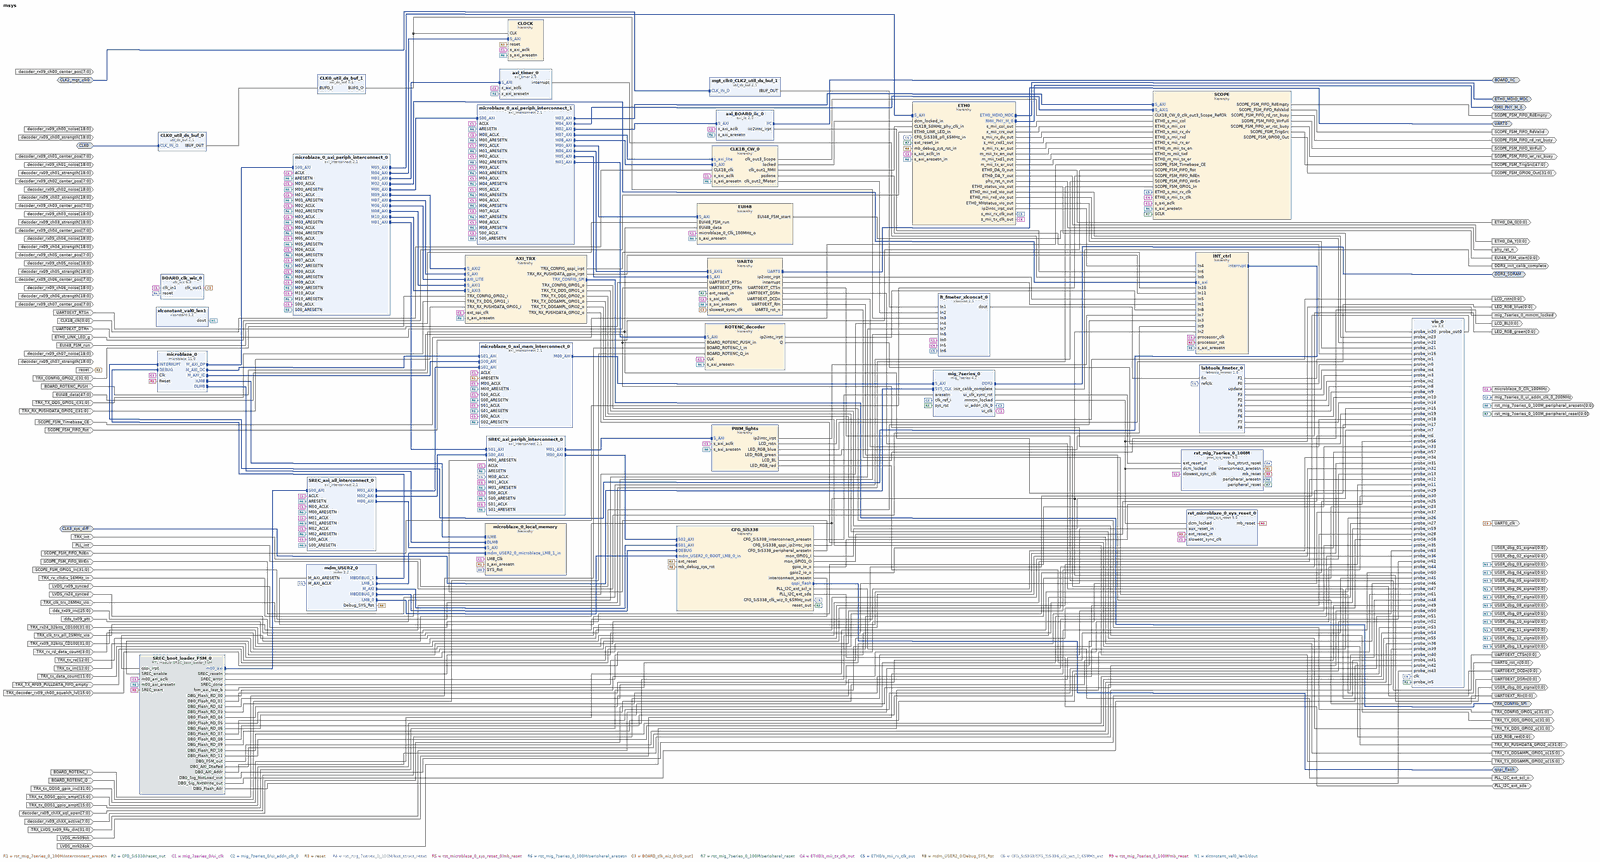
[diagram p0: block diagram of the top level, whole]
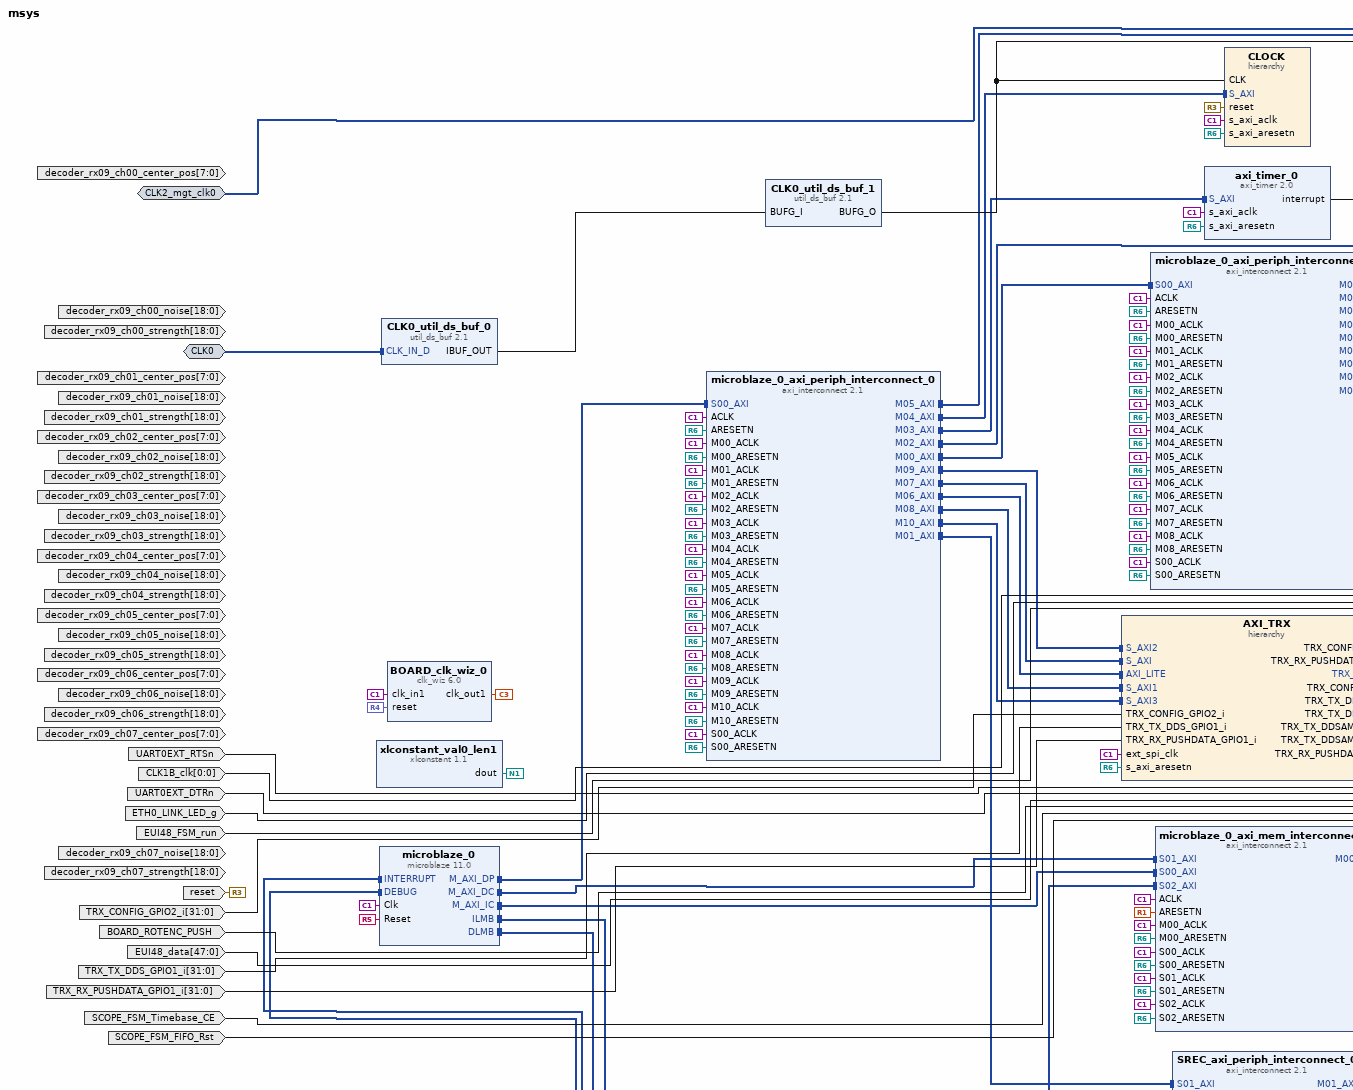
[diagram p1: block diagram of the top level, upper left part]
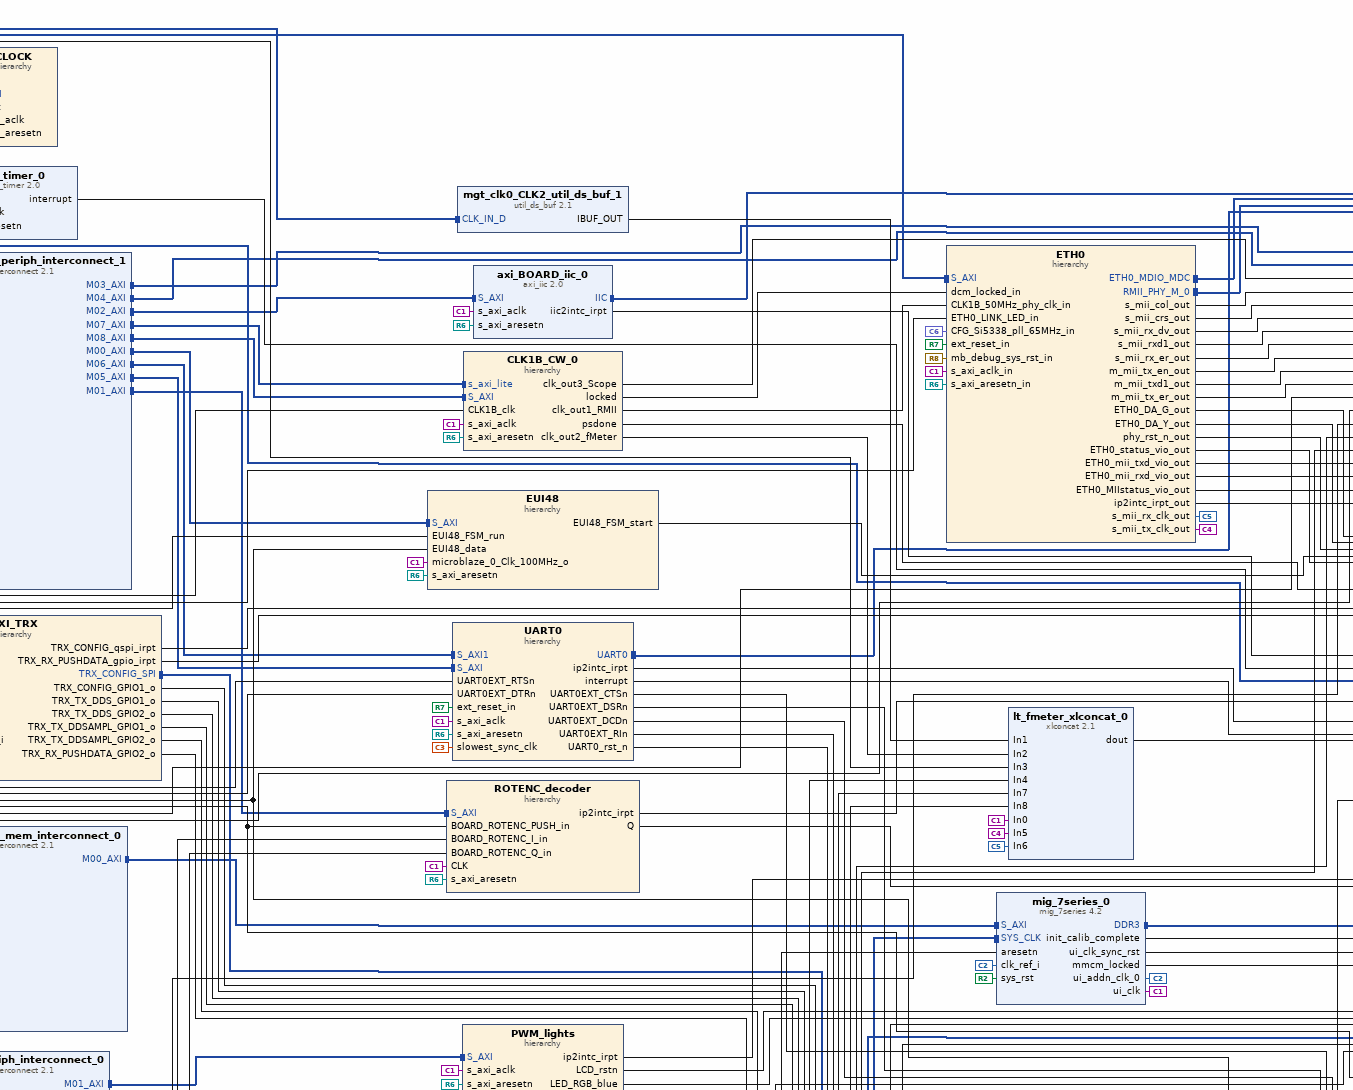
[diagram p2: block diagram of the top level, upper centre part]
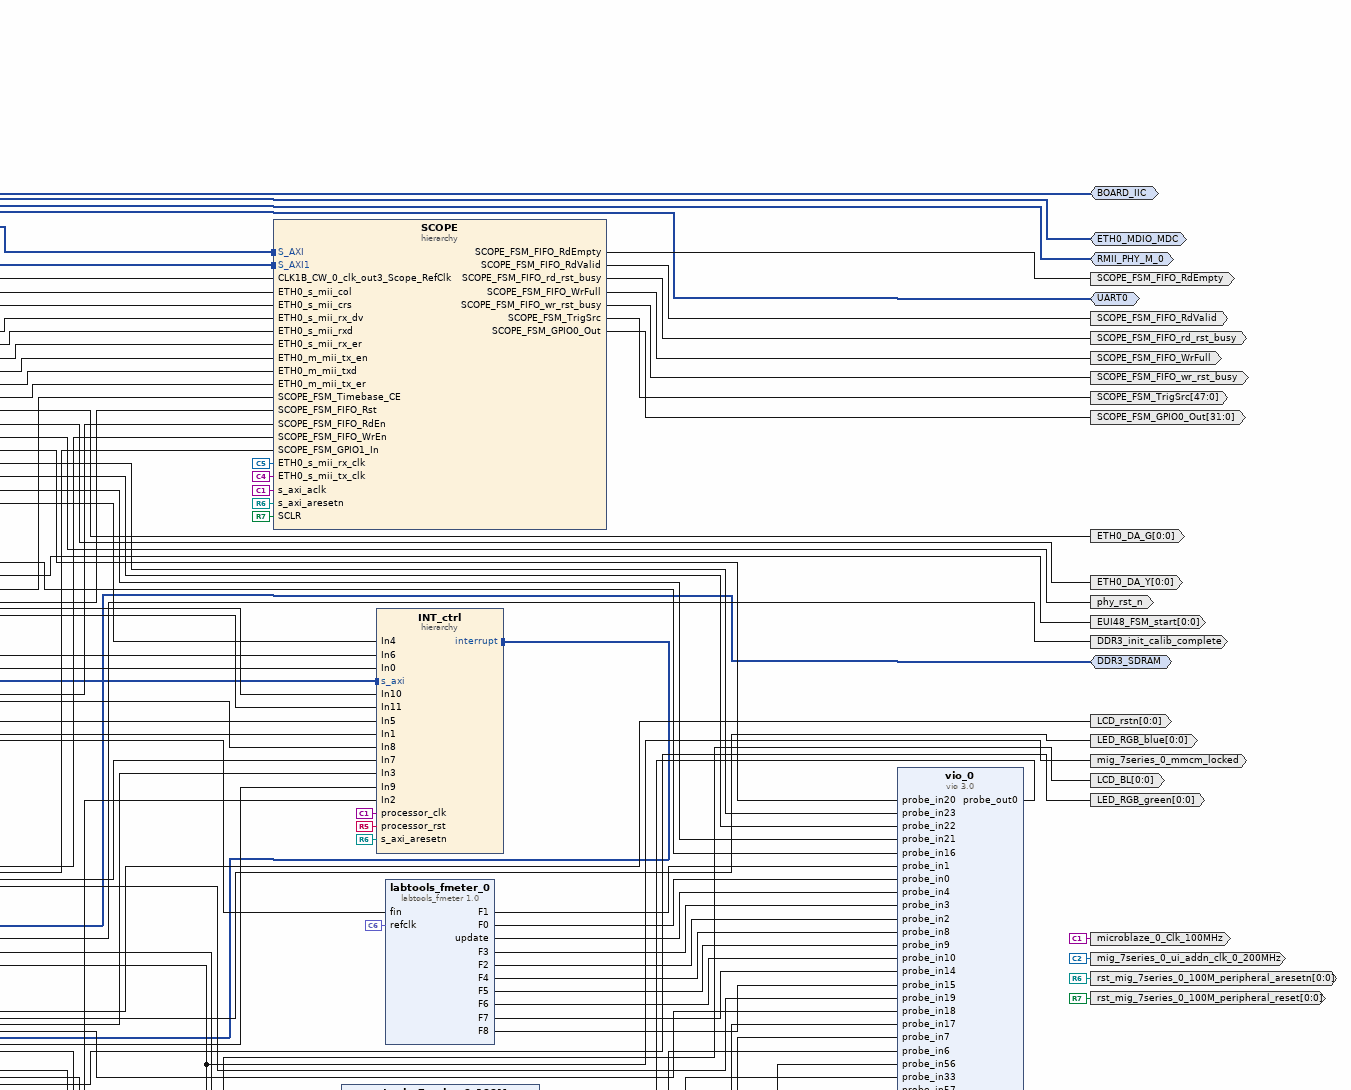
[diagram p3: block diagram of the top level, upper right part]
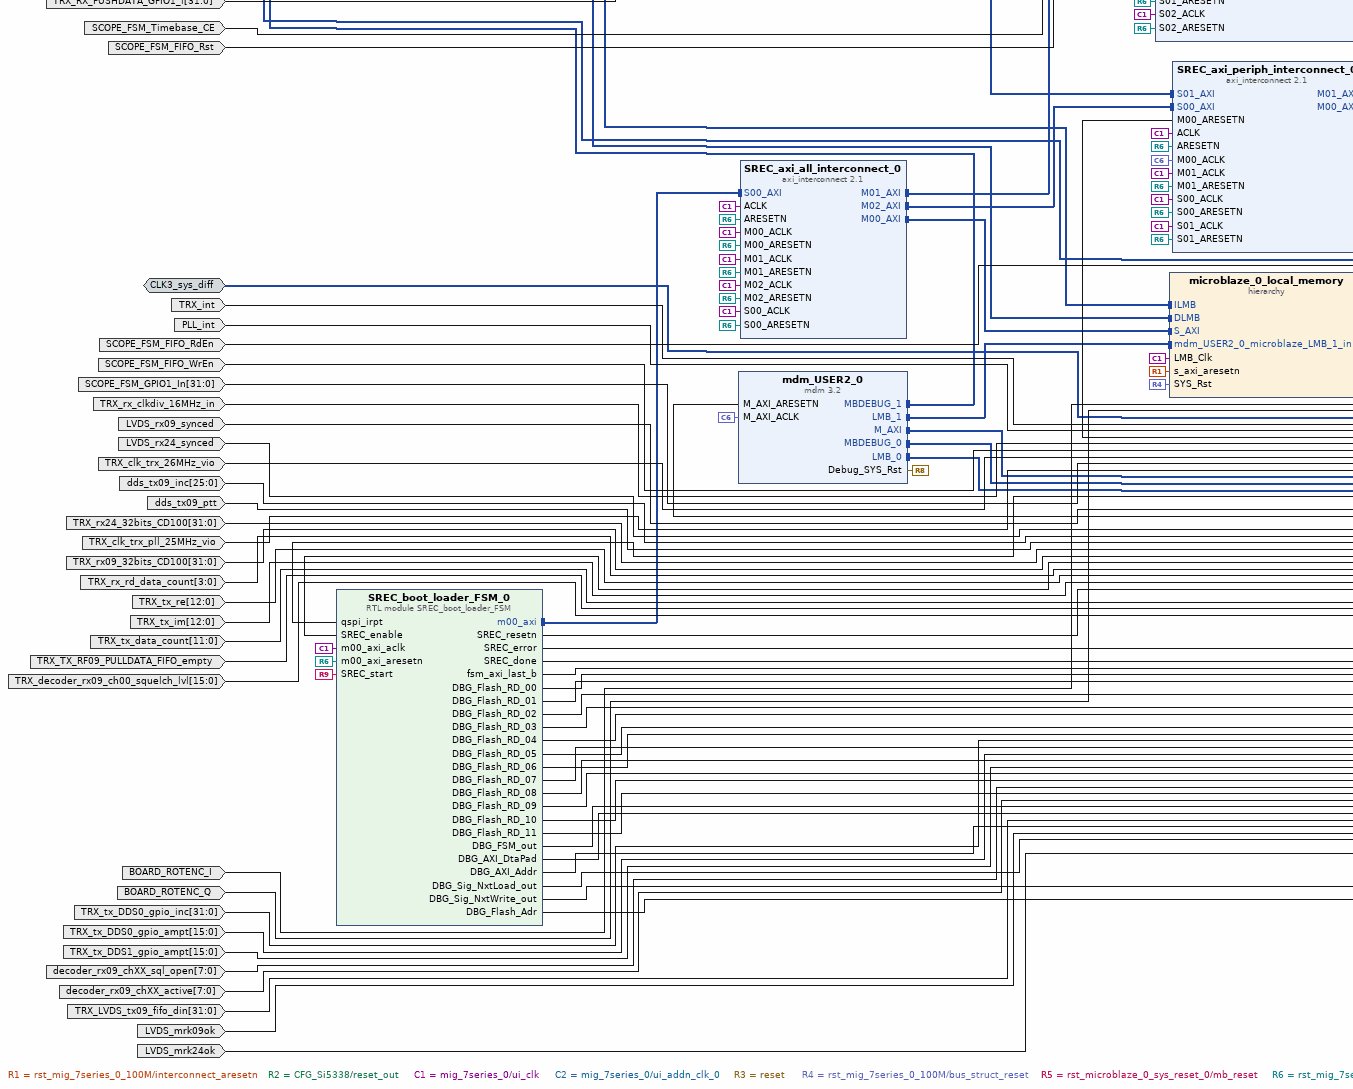
[diagram p4: block diagram of the top level, lower left part]
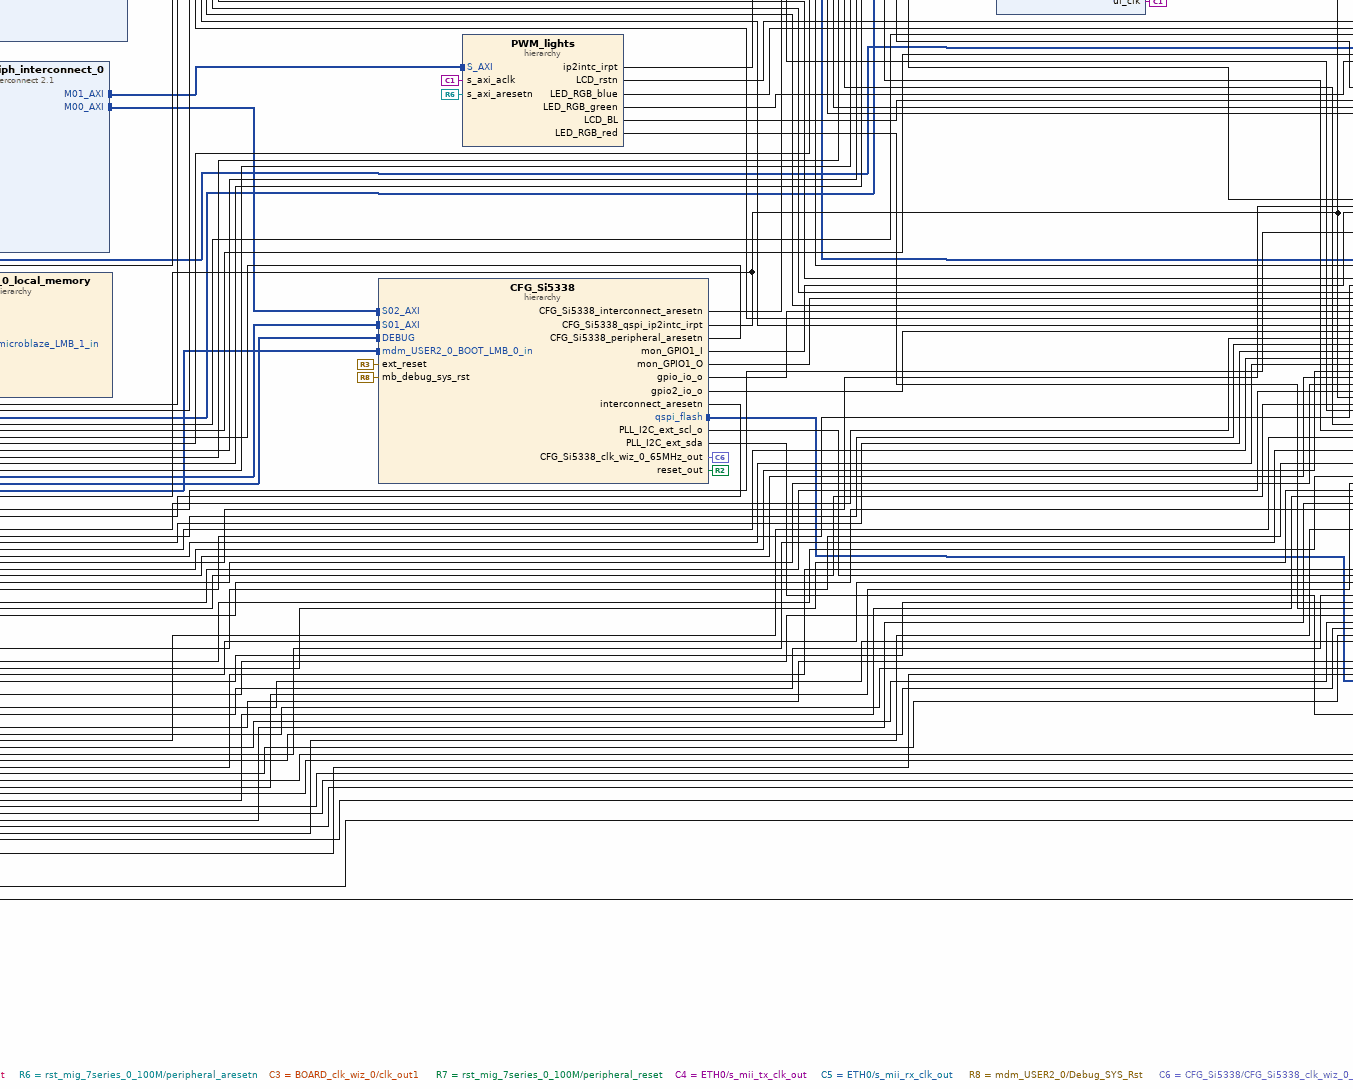
[diagram p5: block diagram of the top level, lower centre part]
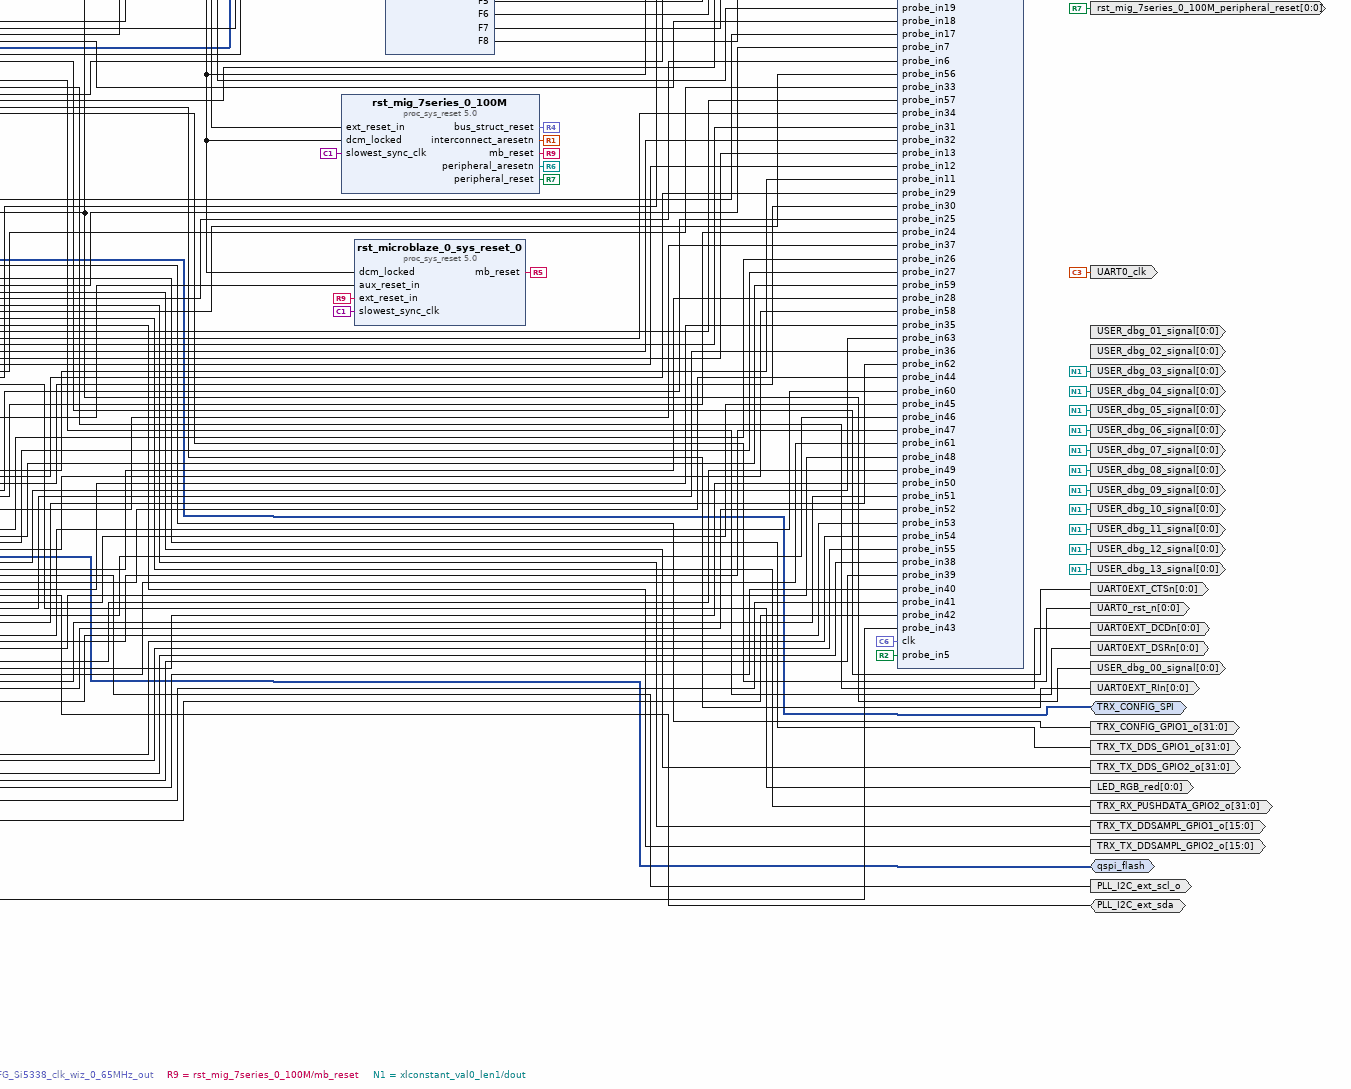
[diagram p6: block diagram of the top level, lower right part]
# Vivado block design msys, xc7a100tfgg484-2, Vivado 2020.2.2
create_bd_design msys

create_bd_intf_port -mode Slave -vlnv xilinx.com:interface:diff_clock_rtl:1.0 CLK0
create_bd_intf_port -mode Master -vlnv xilinx.com:interface:ddrx_rtl:1.0 DDR3_SDRAM
create_bd_intf_port -mode Master -vlnv xilinx.com:interface:mdio_rtl:1.0 ETH0_MDIO_MDC
create_bd_intf_port -mode Master -vlnv xilinx.com:interface:rmii_rtl:1.0 RMII_PHY_M_0
create_bd_intf_port -mode Master -vlnv xilinx.com:interface:uart_rtl:1.0 UART0
create_bd_intf_port -mode Slave -vlnv xilinx.com:interface:diff_clock_rtl:1.0 CLK2_mgt_clk0
set_property -dict {CONFIG.FREQ_HZ 125000000} [get_bd_intf_ports CLK2_mgt_clk0]
create_bd_intf_port -mode Master -vlnv xilinx.com:interface:spi_rtl:1.0 qspi_flash
create_bd_intf_port -mode Slave -vlnv xilinx.com:interface:diff_clock_rtl:1.0 CLK3_sys_diff
set_property -dict {CONFIG.FREQ_HZ 50000000} [get_bd_intf_ports CLK3_sys_diff]
create_bd_intf_port -mode Master -vlnv xilinx.com:interface:iic_rtl:1.0 BOARD_IIC
create_bd_intf_port -mode Master -vlnv xilinx.com:interface:spi_rtl:1.0 TRX_CONFIG_SPI
create_bd_port -dir O PLL_I2C_ext_scl_o
create_bd_port -dir IO PLL_I2C_ext_sda
create_bd_port -dir O phy_rst_n
create_bd_port -dir I -type rst reset
set_property -dict {CONFIG.POLARITY ACTIVE_HIGH} [get_bd_ports reset]
create_bd_port -dir I UART0EXT_RTSn
create_bd_port -dir I UART0EXT_DTRn
create_bd_port -dir O -from 0 -to 0 UART0EXT_CTSn
create_bd_port -dir O -from 0 -to 0 UART0EXT_DSRn
create_bd_port -dir O -from 0 -to 0 UART0EXT_DCDn
create_bd_port -dir O -from 0 -to 0 UART0EXT_RIn
create_bd_port -dir O -from 0 -to 0 -type rst UART0_rst_n
create_bd_port -dir O -type clk UART0_clk
set_property -dict {CONFIG.ASSOCIATED_RESET UART0_rst_n CONFIG.FREQ_HZ 12000000} [get_bd_ports UART0_clk]
create_bd_port -dir O DDR3_init_calib_complete
create_bd_port -dir O -from 0 -to 0 ETH0_DA_Y
create_bd_port -dir O -from 0 -to 0 ETH0_DA_G
create_bd_port -dir I ETH0_LINK_LED_g
create_bd_port -dir O -from 0 -to 0 LED_RGB_red
create_bd_port -dir O -from 0 -to 0 LED_RGB_green
create_bd_port -dir O -from 0 -to 0 LED_RGB_blue
create_bd_port -dir O -from 0 -to 0 LCD_BL
create_bd_port -dir O -from 0 -to 0 -type rst LCD_rstn
create_bd_port -dir O -type clk microblaze_0_Clk_100MHz
set_property -dict {CONFIG.ASSOCIATED_RESET rst_mig_7series_0_100M_peripheral_aresetn} [get_bd_ports microblaze_0_Clk_100MHz]
create_bd_port -dir I BOARD_ROTENC_PUSH
create_bd_port -dir I -type intr PLL_int
create_bd_port -dir I -type intr TRX_int
create_bd_port -dir I -from 0 -to 0 -type clk CLK1B_clk
set_property -dict {CONFIG.FREQ_HZ 50000000} [get_bd_ports CLK1B_clk]
create_bd_port -dir O -from 0 -to 0 EUI48_FSM_start
create_bd_port -dir I EUI48_FSM_run
create_bd_port -dir I -from 47 -to 0 -type data EUI48_data
create_bd_port -dir I -type ce SCOPE_FSM_Timebase_CE
set_property -dict {CONFIG.POLARITY ACTIVE_HIGH} [get_bd_ports SCOPE_FSM_Timebase_CE]
create_bd_port -dir I -type rst SCOPE_FSM_FIFO_Rst
set_property -dict {CONFIG.POLARITY ACTIVE_HIGH} [get_bd_ports SCOPE_FSM_FIFO_Rst]
create_bd_port -dir I SCOPE_FSM_FIFO_RdEn
create_bd_port -dir O SCOPE_FSM_FIFO_WrFull
create_bd_port -dir O SCOPE_FSM_FIFO_RdValid
create_bd_port -dir O SCOPE_FSM_FIFO_RdEmpty
create_bd_port -dir O -from 47 -to 0 SCOPE_FSM_TrigSrc
create_bd_port -dir I SCOPE_FSM_FIFO_WrEn
create_bd_port -dir O SCOPE_FSM_FIFO_rd_rst_busy
create_bd_port -dir O SCOPE_FSM_FIFO_wr_rst_busy
create_bd_port -dir O -from 31 -to 0 SCOPE_FSM_GPIO0_Out
create_bd_port -dir I -from 31 -to 0 SCOPE_FSM_GPIO1_In
create_bd_port -dir I LVDS_rx09_synced
create_bd_port -dir I LVDS_rx24_synced
create_bd_port -dir I -from 7 -to 0 -type data decoder_rx09_ch00_center_pos
create_bd_port -dir I -from 18 -to 0 -type data decoder_rx09_ch00_strength
create_bd_port -dir I -from 18 -to 0 -type data decoder_rx09_ch00_noise
create_bd_port -dir I -from 25 -to 0 dds_tx09_inc
create_bd_port -dir I dds_tx09_ptt
create_bd_port -dir O mig_7series_0_mmcm_locked
create_bd_port -dir O -from 0 -to 0 -type rst rst_mig_7series_0_100M_peripheral_reset
create_bd_port -dir I -type clk TRX_rx_clkdiv_16MHz_in
set_property -dict {CONFIG.FREQ_HZ 16000000} [get_bd_ports TRX_rx_clkdiv_16MHz_in]
create_bd_port -dir I -from 31 -to 0 -type data TRX_rx24_32bits_CD100
create_bd_port -dir I -from 31 -to 0 -type data TRX_rx09_32bits_CD100
create_bd_port -dir I -from 3 -to 0 -type data TRX_rx_rd_data_count
create_bd_port -dir I -type clk TRX_clk_trx_26MHz_vio
set_property -dict {CONFIG.FREQ_HZ 26000000} [get_bd_ports TRX_clk_trx_26MHz_vio]
create_bd_port -dir I -type clk TRX_clk_trx_pll_25MHz_vio
set_property -dict {CONFIG.FREQ_HZ 25000000} [get_bd_ports TRX_clk_trx_pll_25MHz_vio]
create_bd_port -dir I -from 12 -to 0 -type data TRX_tx_re
create_bd_port -dir I -from 12 -to 0 -type data TRX_tx_im
create_bd_port -dir I -from 11 -to 0 -type data TRX_tx_data_count
create_bd_port -dir I TRX_TX_RF09_PULLDATA_FIFO_empty
create_bd_port -dir I -from 15 -to 0 -type data TRX_decoder_rx09_ch00_squelch_lvl
create_bd_port -dir I -from 31 -to 0 -type data TRX_tx_DDS0_gpio_inc
create_bd_port -dir I -from 15 -to 0 -type data TRX_tx_DDS0_gpio_ampt
create_bd_port -dir I -from 15 -to 0 -type data TRX_tx_DDS1_gpio_ampt
create_bd_port -dir O -type clk mig_7series_0_ui_addn_clk_0_200MHz
create_bd_port -dir I -from 7 -to 0 decoder_rx09_chXX_sql_open
create_bd_port -dir I -from 7 -to 0 decoder_rx09_chXX_active
create_bd_port -dir I -from 18 -to 0 -type data decoder_rx09_ch01_noise
create_bd_port -dir I -from 18 -to 0 -type data decoder_rx09_ch02_noise
create_bd_port -dir I -from 18 -to 0 -type data decoder_rx09_ch03_noise
create_bd_port -dir I -from 18 -to 0 -type data decoder_rx09_ch04_noise
create_bd_port -dir I -from 18 -to 0 -type data decoder_rx09_ch05_noise
create_bd_port -dir I -from 18 -to 0 -type data decoder_rx09_ch06_noise
create_bd_port -dir I -from 18 -to 0 -type data decoder_rx09_ch07_noise
create_bd_port -dir I -from 18 -to 0 -type data decoder_rx09_ch01_strength
create_bd_port -dir I -from 18 -to 0 -type data decoder_rx09_ch02_strength
create_bd_port -dir I -from 18 -to 0 -type data decoder_rx09_ch03_strength
create_bd_port -dir I -from 18 -to 0 -type data decoder_rx09_ch04_strength
create_bd_port -dir I -from 18 -to 0 -type data decoder_rx09_ch05_strength
create_bd_port -dir I -from 18 -to 0 -type data decoder_rx09_ch06_strength
create_bd_port -dir I -from 18 -to 0 -type data decoder_rx09_ch07_strength
create_bd_port -dir I -from 7 -to 0 -type data decoder_rx09_ch01_center_pos
create_bd_port -dir I -from 7 -to 0 -type data decoder_rx09_ch02_center_pos
create_bd_port -dir I -from 7 -to 0 -type data decoder_rx09_ch03_center_pos
create_bd_port -dir I -from 7 -to 0 -type data decoder_rx09_ch04_center_pos
create_bd_port -dir I -from 7 -to 0 -type data decoder_rx09_ch05_center_pos
create_bd_port -dir I -from 7 -to 0 -type data decoder_rx09_ch06_center_pos
create_bd_port -dir I -from 7 -to 0 -type data decoder_rx09_ch07_center_pos
create_bd_port -dir O -from 31 -to 0 TRX_CONFIG_GPIO1_o
create_bd_port -dir I -from 31 -to 0 TRX_CONFIG_GPIO2_i
create_bd_port -dir O -from 31 -to 0 TRX_TX_DDS_GPIO1_o
create_bd_port -dir I -from 31 -to 0 TRX_TX_DDS_GPIO1_i
create_bd_port -dir O -from 31 -to 0 TRX_TX_DDS_GPIO2_o
create_bd_port -dir O -from 15 -to 0 TRX_TX_DDSAMPL_GPIO1_o
create_bd_port -dir O -from 15 -to 0 TRX_TX_DDSAMPL_GPIO2_o
create_bd_port -dir I -from 31 -to 0 TRX_RX_PUSHDATA_GPIO1_i
create_bd_port -dir O -from 31 -to 0 TRX_RX_PUSHDATA_GPIO2_o
create_bd_port -dir I -from 31 -to 0 -type data TRX_LVDS_tx09_fifo_din
create_bd_port -dir I LVDS_mrk09ok
create_bd_port -dir I LVDS_mrk24ok
create_bd_port -dir O -from 0 -to 0 -type rst rst_mig_7series_0_100M_peripheral_aresetn
create_bd_port -dir O -from 0 -to 0 USER_dbg_02_signal
create_bd_port -dir O -from 0 -to 0 USER_dbg_00_signal
create_bd_port -dir O -from 0 -to 0 USER_dbg_04_signal
create_bd_port -dir O -from 0 -to 0 USER_dbg_05_signal
create_bd_port -dir O -from 0 -to 0 USER_dbg_06_signal
create_bd_port -dir O -from 0 -to 0 USER_dbg_07_signal
create_bd_port -dir O -from 0 -to 0 USER_dbg_08_signal
create_bd_port -dir O -from 0 -to 0 USER_dbg_09_signal
create_bd_port -dir O -from 0 -to 0 USER_dbg_10_signal
create_bd_port -dir O -from 0 -to 0 USER_dbg_11_signal
create_bd_port -dir O -from 0 -to 0 USER_dbg_12_signal
create_bd_port -dir O -from 0 -to 0 USER_dbg_13_signal
create_bd_port -dir O -from 0 -to 0 USER_dbg_01_signal
create_bd_port -dir O -from 0 -to 0 USER_dbg_03_signal
create_bd_port -dir I BOARD_ROTENC_I
create_bd_port -dir I BOARD_ROTENC_Q

create_bd_cell -type ip -vlnv trenz.biz:user:labtools_fmeter:1.0 labtools_fmeter_0
set_property -dict {CONFIG.C_CHANNELS 9 CONFIG.C_REFCLK_HZ 65000000} [get_bd_cells labtools_fmeter_0]
create_bd_cell -type hier microblaze_0_local_memory
create_bd_cell -type ip -vlnv xilinx.com:ip:mig_7series:4.2 mig_7series_0
set_property -dict [list \
  CONFIG.BOARD_MIG_PARAM DDR3_SDRAM \
  CONFIG.RESET_BOARD_INTERFACE Custom \
  CONFIG.XML_INPUT_FILE mig_a.prj \
] [get_bd_cells mig_7series_0]
create_bd_cell -type ip -vlnv xilinx.com:ip:proc_sys_reset:5.0 rst_mig_7series_0_100M
create_bd_cell -type ip -vlnv xilinx.com:ip:vio:3.0 vio_0
set_property -dict [list \
  CONFIG.C_NUM_PROBE_IN 64 \
  CONFIG.C_NUM_PROBE_OUT 1 \
  CONFIG.C_PROBE_OUT0_INIT_VAL 1 \
  CONFIG.C_PROBE_OUT0_WIDTH 1 \
  CONFIG.C_PROBE_OUT1_INIT_VAL 0x00100 \
  CONFIG.C_PROBE_OUT1_WIDTH 19 \
] [get_bd_cells vio_0]
create_bd_cell -type hier UART0
create_bd_cell -type hier PWM_lights
create_bd_cell -type hier ROTENC_decoder
create_bd_cell -type hier ETH0
create_bd_cell -type hier INT_ctrl
create_bd_cell -type hier EUI48
create_bd_cell -type hier CLK1B_CW_0
create_bd_cell -type hier SCOPE
create_bd_cell -type hier CFG_Si5338
create_bd_cell -type hier CLOCK
create_bd_cell -type hier AXI_TRX
create_bd_cell -type ip -vlnv xilinx.com:ip:proc_sys_reset:5.0 rst_microblaze_0_sys_reset_0
create_bd_cell -type ip -vlnv xilinx.com:ip:xlconstant:1.1 xlconstant_val0_len1
create_bd_cell -type ip -vlnv xilinx.com:ip:util_ds_buf:2.1 CLK0_util_ds_buf_1
set_property -dict {CONFIG.C_BUF_TYPE BUFG} [get_bd_cells CLK0_util_ds_buf_1]
create_bd_cell -type ip -vlnv xilinx.com:ip:axi_iic:2.0 axi_BOARD_iic_0
create_bd_cell -type ip -vlnv xilinx.com:ip:axi_interconnect:2.1 microblaze_0_axi_mem_interconnect_0
set_property -dict [list \
  CONFIG.ENABLE_ADVANCED_OPTIONS 0 \
  CONFIG.NUM_MI 1 \
  CONFIG.NUM_SI 3 \
] [get_bd_cells microblaze_0_axi_mem_interconnect_0]
create_bd_cell -type ip -vlnv xilinx.com:ip:axi_interconnect:2.1 SREC_axi_all_interconnect_0
set_property -dict {CONFIG.NUM_MI 3} [get_bd_cells SREC_axi_all_interconnect_0]
create_bd_cell -type ip -vlnv xilinx.com:ip:axi_interconnect:2.1 SREC_axi_periph_interconnect_0
set_property -dict {CONFIG.NUM_MI 2 CONFIG.NUM_SI 2} [get_bd_cells SREC_axi_periph_interconnect_0]
create_bd_cell -type ip -vlnv xilinx.com:ip:axi_timer:2.0 axi_timer_0
create_bd_cell -type ip -vlnv xilinx.com:ip:clk_wiz:6.0 BOARD_clk_wiz_0
set_property -dict [list \
  CONFIG.CLKOUT1_DRIVES BUFG \
  CONFIG.CLKOUT1_JITTER 345.775 \
  CONFIG.CLKOUT1_PHASE_ERROR 293.793 \
  CONFIG.CLKOUT1_REQUESTED_OUT_FREQ 12.000 \
  CONFIG.CLKOUT1_USED true \
  CONFIG.CLKOUT2_DRIVES BUFG \
  CONFIG.CLKOUT2_JITTER 137.681 \
  CONFIG.CLKOUT2_PHASE_ERROR 105.461 \
  CONFIG.CLKOUT2_REQUESTED_OUT_FREQ 100.000 \
  CONFIG.CLKOUT2_USED false \
  CONFIG.CLKOUT3_DRIVES BUFG \
  CONFIG.CLKOUT4_DRIVES BUFG \
  CONFIG.CLKOUT5_DRIVES BUFG \
  CONFIG.CLKOUT6_DRIVES BUFG \
  CONFIG.CLKOUT7_DRIVES BUFG \
  CONFIG.FEEDBACK_SOURCE FDBK_AUTO \
  CONFIG.MMCM_BANDWIDTH OPTIMIZED \
  CONFIG.MMCM_CLKFBOUT_MULT_F 49.875 \
  CONFIG.MMCM_CLKOUT0_DIVIDE_F 83.125 \
  CONFIG.MMCM_CLKOUT1_DIVIDE 1 \
  CONFIG.MMCM_COMPENSATION ZHOLD \
  CONFIG.MMCM_DIVCLK_DIVIDE 5 \
  CONFIG.NUM_OUT_CLKS 1 \
  CONFIG.PRIMITIVE MMCM \
  CONFIG.USE_LOCKED false \
] [get_bd_cells BOARD_clk_wiz_0]
create_bd_cell -type ip -vlnv xilinx.com:ip:mdm:3.2 mdm_USER2_0
set_property -dict [list \
  CONFIG.C_ADDR_SIZE 32 \
  CONFIG.C_DBG_MEM_ACCESS 1 \
  CONFIG.C_MB_DBG_PORTS 2 \
  CONFIG.C_M_AXI_ADDR_WIDTH 32 \
] [get_bd_cells mdm_USER2_0]
create_bd_cell -type ip -vlnv xilinx.com:ip:microblaze:11.0 microblaze_0
set_property -dict [list \
  CONFIG.C_ADDR_TAG_BITS 15 \
  CONFIG.C_AREA_OPTIMIZED 0 \
  CONFIG.C_BASE_VECTORS 0x0000000000010000 \
  CONFIG.C_BRANCH_TARGET_CACHE_SIZE 0 \
  CONFIG.C_CACHE_BYTE_SIZE 32768 \
  CONFIG.C_DCACHE_ADDR_TAG 15 \
  CONFIG.C_DCACHE_BYTE_SIZE 32768 \
  CONFIG.C_DCACHE_FORCE_TAG_LUTRAM 1 \
  CONFIG.C_DCACHE_LINE_LEN 16 \
  CONFIG.C_DCACHE_USE_WRITEBACK 1 \
  CONFIG.C_DCACHE_VICTIMS 4 \
  CONFIG.C_DEBUG_ENABLED 2 \
  CONFIG.C_DIV_ZERO_EXCEPTION 0 \
  CONFIG.C_D_AXI 1 \
  CONFIG.C_D_LMB 1 \
  CONFIG.C_ENABLE_DISCRETE_PORTS 0 \
  CONFIG.C_ICACHE_DATA_WIDTH 0 \
  CONFIG.C_ICACHE_FORCE_TAG_LUTRAM 1 \
  CONFIG.C_ICACHE_LINE_LEN 16 \
  CONFIG.C_ICACHE_STREAMS 0 \
  CONFIG.C_ICACHE_VICTIMS 8 \
  CONFIG.C_ILL_OPCODE_EXCEPTION 0 \
  CONFIG.C_I_LMB 1 \
  CONFIG.C_M_AXI_D_BUS_EXCEPTION 1 \
  CONFIG.C_M_AXI_I_BUS_EXCEPTION 0 \
  CONFIG.C_NUMBER_OF_PC_BRK 5 \
  CONFIG.C_NUMBER_OF_RD_ADDR_BRK 1 \
  CONFIG.C_NUMBER_OF_WR_ADDR_BRK 1 \
  CONFIG.C_PVR 0 \
  CONFIG.C_UNALIGNED_EXCEPTIONS 1 \
  CONFIG.C_USE_BARREL 1 \
  CONFIG.C_USE_BRANCH_TARGET_CACHE 1 \
  CONFIG.C_USE_DCACHE 1 \
  CONFIG.C_USE_DIV 1 \
  CONFIG.C_USE_FPU 0 \
  CONFIG.C_USE_HW_MUL 1 \
  CONFIG.C_USE_ICACHE 1 \
  CONFIG.C_USE_MSR_INSTR 1 \
  CONFIG.C_USE_PCMP_INSTR 1 \
  CONFIG.C_USE_REORDER_INSTR 1 \
  CONFIG.C_USE_STACK_PROTECTION 1 \
  CONFIG.G_TEMPLATE_LIST 6 \
  CONFIG.G_USE_EXCEPTIONS 1 \
] [get_bd_cells microblaze_0]
create_bd_cell -type ip -vlnv xilinx.com:ip:axi_interconnect:2.1 microblaze_0_axi_periph_interconnect_0
set_property -dict {CONFIG.NUM_MI 11 CONFIG.NUM_SI 1} [get_bd_cells microblaze_0_axi_periph_interconnect_0]
create_bd_cell -type ip -vlnv xilinx.com:ip:axi_interconnect:2.1 microblaze_0_axi_periph_interconnect_1
set_property -dict {CONFIG.NUM_MI 9 CONFIG.NUM_SI 1} [get_bd_cells microblaze_0_axi_periph_interconnect_1]
create_bd_cell -type ip -vlnv xilinx.com:ip:util_ds_buf:2.1 mgt_clk0_CLK2_util_ds_buf_1
set_property -dict [list \
  CONFIG.DIFF_CLK_IN_BOARD_INTERFACE mgt_clk0 \
  CONFIG.USE_BOARD_FLOW true \
] [get_bd_cells mgt_clk0_CLK2_util_ds_buf_1]
create_bd_cell -type ip -vlnv xilinx.com:ip:util_ds_buf:2.1 CLK0_util_ds_buf_0
set_property -dict {CONFIG.C_BUF_TYPE IBUFDS} [get_bd_cells CLK0_util_ds_buf_0]
create_bd_cell -type ip -vlnv xilinx.com:ip:xlconcat:2.1 lt_fmeter_xlconcat_0
set_property -dict {CONFIG.NUM_PORTS 9 CONFIG.dout_width 9} [get_bd_cells lt_fmeter_xlconcat_0]
create_bd_cell -type module -reference SREC_boot_loader_FSM SREC_boot_loader_FSM_0

# ---- hierarchy /microblaze_0_local_memory ----
current_bd_instance /microblaze_0_local_memory
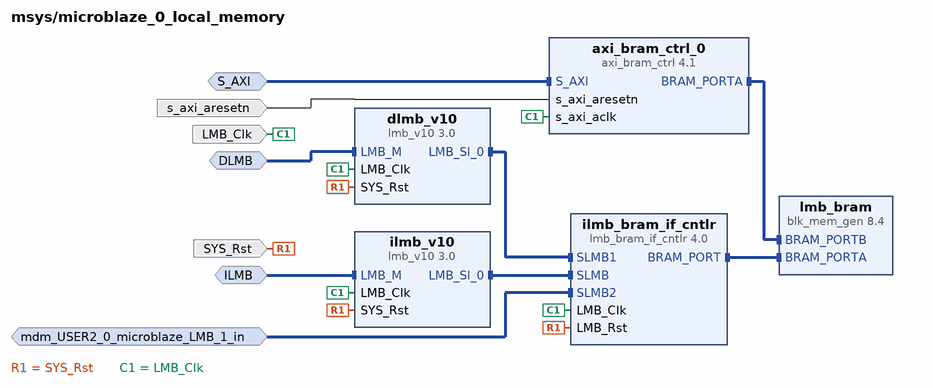
[diagram p7: block diagram inside /microblaze_0_local_memory]
create_bd_intf_pin -mode MirroredMaster -vlnv xilinx.com:interface:lmb_rtl:1.0 DLMB
create_bd_intf_pin -mode MirroredMaster -vlnv xilinx.com:interface:lmb_rtl:1.0 ILMB
create_bd_intf_pin -mode Slave -vlnv xilinx.com:interface:lmb_rtl:1.0 mdm_USER2_0_microblaze_LMB_1_in
create_bd_intf_pin -mode Slave -vlnv xilinx.com:interface:aximm_rtl:1.0 S_AXI
create_bd_pin -dir I -type clk LMB_Clk
create_bd_pin -dir I -type rst SYS_Rst
create_bd_pin -dir I -type rst s_axi_aresetn

create_bd_cell -type ip -vlnv xilinx.com:ip:blk_mem_gen:8.4 lmb_bram
set_property -dict {CONFIG.Memory_Type True_Dual_Port_RAM CONFIG.use_bram_block BRAM_Controller} [get_bd_cells lmb_bram]
create_bd_cell -type ip -vlnv xilinx.com:ip:lmb_v10:3.0 dlmb_v10
create_bd_cell -type ip -vlnv xilinx.com:ip:lmb_v10:3.0 ilmb_v10
create_bd_cell -type ip -vlnv xilinx.com:ip:axi_bram_ctrl:4.1 axi_bram_ctrl_0
set_property -dict {CONFIG.PROTOCOL AXI4LITE CONFIG.SINGLE_PORT_BRAM 1} [get_bd_cells axi_bram_ctrl_0]
create_bd_cell -type ip -vlnv xilinx.com:ip:lmb_bram_if_cntlr:4.0 ilmb_bram_if_cntlr
set_property -dict {CONFIG.C_ECC 0 CONFIG.C_NUM_LMB 3} [get_bd_cells ilmb_bram_if_cntlr]

# ---- hierarchy /UART0 ----
current_bd_instance /UART0
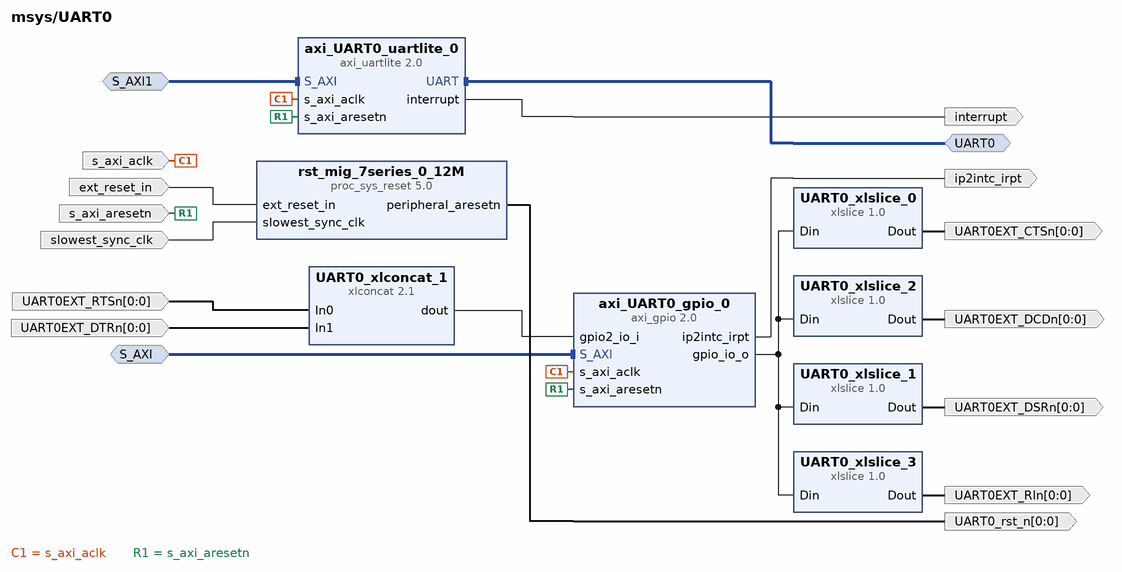
[diagram p8: block diagram inside /UART0]
create_bd_intf_pin -mode Slave -vlnv xilinx.com:interface:aximm_rtl:1.0 S_AXI
create_bd_intf_pin -mode Slave -vlnv xilinx.com:interface:aximm_rtl:1.0 S_AXI1
create_bd_intf_pin -mode Master -vlnv xilinx.com:interface:uart_rtl:1.0 UART0
create_bd_pin -dir O -from 0 -to 0 UART0EXT_CTSn
create_bd_pin -dir O -from 0 -to 0 UART0EXT_DSRn
create_bd_pin -dir O -from 0 -to 0 UART0EXT_DCDn
create_bd_pin -dir O -from 0 -to 0 UART0EXT_RIn
create_bd_pin -dir O -type intr ip2intc_irpt
create_bd_pin -dir I -type clk s_axi_aclk
create_bd_pin -dir I -type rst s_axi_aresetn
create_bd_pin -dir I -from 0 -to 0 UART0EXT_RTSn
create_bd_pin -dir I -from 0 -to 0 UART0EXT_DTRn
create_bd_pin -dir I -type rst ext_reset_in
create_bd_pin -dir I -type clk slowest_sync_clk
create_bd_pin -dir O -from 0 -to 0 -type rst UART0_rst_n
create_bd_pin -dir O -type intr interrupt

create_bd_cell -type ip -vlnv xilinx.com:ip:xlslice:1.0 UART0_xlslice_0
set_property -dict {CONFIG.DIN_WIDTH 4} [get_bd_cells UART0_xlslice_0]
create_bd_cell -type ip -vlnv xilinx.com:ip:xlslice:1.0 UART0_xlslice_1
set_property -dict {CONFIG.DIN_FROM 1 CONFIG.DIN_TO 1 CONFIG.DIN_WIDTH 4 CONFIG.DOUT_WIDTH 1} [get_bd_cells UART0_xlslice_1]
create_bd_cell -type ip -vlnv xilinx.com:ip:xlslice:1.0 UART0_xlslice_2
set_property -dict {CONFIG.DIN_FROM 2 CONFIG.DIN_TO 2 CONFIG.DIN_WIDTH 4 CONFIG.DOUT_WIDTH 1} [get_bd_cells UART0_xlslice_2]
create_bd_cell -type ip -vlnv xilinx.com:ip:xlslice:1.0 UART0_xlslice_3
set_property -dict {CONFIG.DIN_FROM 3 CONFIG.DIN_TO 3 CONFIG.DIN_WIDTH 4 CONFIG.DOUT_WIDTH 1} [get_bd_cells UART0_xlslice_3]
create_bd_cell -type ip -vlnv xilinx.com:ip:proc_sys_reset:5.0 rst_mig_7series_0_12M
create_bd_cell -type ip -vlnv xilinx.com:ip:axi_gpio:2.0 axi_UART0_gpio_0
set_property -dict [list \
  CONFIG.C_ALL_INPUTS 0 \
  CONFIG.C_ALL_INPUTS_2 1 \
  CONFIG.C_ALL_OUTPUTS 1 \
  CONFIG.C_DOUT_DEFAULT 0x0000000f \
  CONFIG.C_GPIO2_WIDTH 2 \
  CONFIG.C_GPIO_WIDTH 4 \
  CONFIG.C_INTERRUPT_PRESENT 1 \
  CONFIG.C_IS_DUAL 1 \
] [get_bd_cells axi_UART0_gpio_0]
create_bd_cell -type ip -vlnv xilinx.com:ip:axi_uartlite:2.0 axi_UART0_uartlite_0
set_property -dict [list \
  CONFIG.C_BAUDRATE 115200 \
  CONFIG.UARTLITE_BOARD_INTERFACE UART0 \
  CONFIG.USE_BOARD_FLOW true \
] [get_bd_cells axi_UART0_uartlite_0]
create_bd_cell -type ip -vlnv xilinx.com:ip:xlconcat:2.1 UART0_xlconcat_1
set_property -dict {CONFIG.NUM_PORTS 2} [get_bd_cells UART0_xlconcat_1]

# ---- hierarchy /PWM_lights ----
current_bd_instance /PWM_lights
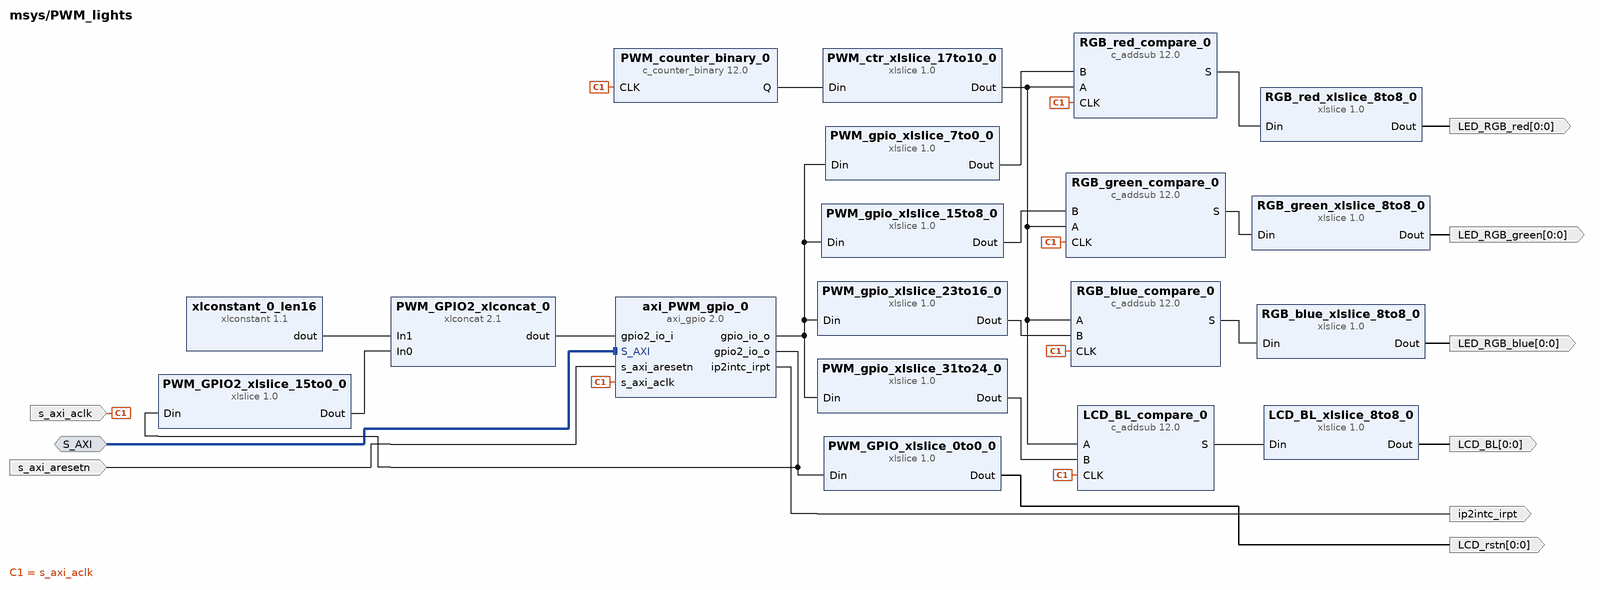
[diagram p9: block diagram inside /PWM_lights]
create_bd_intf_pin -mode Slave -vlnv xilinx.com:interface:aximm_rtl:1.0 S_AXI
create_bd_pin -dir O -type intr ip2intc_irpt
create_bd_pin -dir I -type clk s_axi_aclk
create_bd_pin -dir I -type rst s_axi_aresetn
create_bd_pin -dir O -from 0 -to 0 LCD_rstn
create_bd_pin -dir O -from 0 -to 0 LED_RGB_blue
create_bd_pin -dir O -from 0 -to 0 LED_RGB_green
create_bd_pin -dir O -from 0 -to 0 LCD_BL
create_bd_pin -dir O -from 0 -to 0 LED_RGB_red

create_bd_cell -type ip -vlnv xilinx.com:ip:c_counter_binary:12.0 PWM_counter_binary_0
set_property -dict {CONFIG.Implementation DSP48 CONFIG.Output_Width 18} [get_bd_cells PWM_counter_binary_0]
create_bd_cell -type ip -vlnv xilinx.com:ip:xlslice:1.0 PWM_ctr_xlslice_17to10_0
set_property -dict [list \
  CONFIG.DIN_FROM 17 \
  CONFIG.DIN_TO 10 \
  CONFIG.DIN_WIDTH 18 \
  CONFIG.DOUT_WIDTH 8 \
] [get_bd_cells PWM_ctr_xlslice_17to10_0]
create_bd_cell -type ip -vlnv xilinx.com:ip:xlslice:1.0 PWM_gpio_xlslice_7to0_0
set_property -dict [list \
  CONFIG.DIN_FROM 7 \
  CONFIG.DIN_TO 0 \
  CONFIG.DIN_WIDTH 32 \
  CONFIG.DOUT_WIDTH 8 \
] [get_bd_cells PWM_gpio_xlslice_7to0_0]
create_bd_cell -type ip -vlnv xilinx.com:ip:xlslice:1.0 PWM_gpio_xlslice_31to24_0
set_property -dict [list \
  CONFIG.DIN_FROM 31 \
  CONFIG.DIN_TO 24 \
  CONFIG.DIN_WIDTH 32 \
  CONFIG.DOUT_WIDTH 8 \
] [get_bd_cells PWM_gpio_xlslice_31to24_0]
create_bd_cell -type ip -vlnv xilinx.com:ip:xlslice:1.0 PWM_gpio_xlslice_15to8_0
set_property -dict [list \
  CONFIG.DIN_FROM 15 \
  CONFIG.DIN_TO 8 \
  CONFIG.DIN_WIDTH 32 \
  CONFIG.DOUT_WIDTH 8 \
] [get_bd_cells PWM_gpio_xlslice_15to8_0]
create_bd_cell -type ip -vlnv xilinx.com:ip:xlslice:1.0 PWM_gpio_xlslice_23to16_0
set_property -dict [list \
  CONFIG.DIN_FROM 23 \
  CONFIG.DIN_TO 16 \
  CONFIG.DIN_WIDTH 32 \
  CONFIG.DOUT_WIDTH 8 \
] [get_bd_cells PWM_gpio_xlslice_23to16_0]
create_bd_cell -type ip -vlnv xilinx.com:ip:c_addsub:12.0 RGB_blue_compare_0
set_property -dict [list \
  CONFIG.A_Type Unsigned \
  CONFIG.A_Width 8 \
  CONFIG.Add_Mode Subtract \
  CONFIG.B_Type Unsigned \
  CONFIG.B_Value 00000000 \
  CONFIG.B_Width 8 \
  CONFIG.CE false \
  CONFIG.Latency 1 \
  CONFIG.Out_Width 9 \
] [get_bd_cells RGB_blue_compare_0]
create_bd_cell -type ip -vlnv xilinx.com:ip:c_addsub:12.0 RGB_green_compare_0
set_property -dict [list \
  CONFIG.A_Type Unsigned \
  CONFIG.A_Width 8 \
  CONFIG.Add_Mode Subtract \
  CONFIG.B_Type Unsigned \
  CONFIG.B_Value 00000000 \
  CONFIG.B_Width 8 \
  CONFIG.CE false \
  CONFIG.Latency 1 \
  CONFIG.Out_Width 9 \
] [get_bd_cells RGB_green_compare_0]
create_bd_cell -type ip -vlnv xilinx.com:ip:c_addsub:12.0 LCD_BL_compare_0
set_property -dict [list \
  CONFIG.A_Type Unsigned \
  CONFIG.A_Width 8 \
  CONFIG.Add_Mode Subtract \
  CONFIG.B_Type Unsigned \
  CONFIG.B_Value 00000000 \
  CONFIG.B_Width 8 \
  CONFIG.CE false \
  CONFIG.Latency 1 \
  CONFIG.Out_Width 9 \
] [get_bd_cells LCD_BL_compare_0]
create_bd_cell -type ip -vlnv xilinx.com:ip:c_addsub:12.0 RGB_red_compare_0
set_property -dict [list \
  CONFIG.A_Type Unsigned \
  CONFIG.A_Width 8 \
  CONFIG.Add_Mode Subtract \
  CONFIG.B_Type Unsigned \
  CONFIG.B_Value 00000000 \
  CONFIG.B_Width 8 \
  CONFIG.CE false \
  CONFIG.Latency 1 \
  CONFIG.Out_Width 9 \
] [get_bd_cells RGB_red_compare_0]
create_bd_cell -type ip -vlnv xilinx.com:ip:xlslice:1.0 PWM_GPIO_xlslice_0to0_0
set_property -dict [list \
  CONFIG.DIN_FROM 0 \
  CONFIG.DIN_TO 0 \
  CONFIG.DIN_WIDTH 32 \
  CONFIG.DOUT_WIDTH 1 \
] [get_bd_cells PWM_GPIO_xlslice_0to0_0]
create_bd_cell -type ip -vlnv xilinx.com:ip:xlslice:1.0 RGB_blue_xlslice_8to8_0
set_property -dict [list \
  CONFIG.DIN_FROM 8 \
  CONFIG.DIN_TO 8 \
  CONFIG.DIN_WIDTH 9 \
  CONFIG.DOUT_WIDTH 1 \
] [get_bd_cells RGB_blue_xlslice_8to8_0]
create_bd_cell -type ip -vlnv xilinx.com:ip:xlslice:1.0 RGB_green_xlslice_8to8_0
set_property -dict [list \
  CONFIG.DIN_FROM 8 \
  CONFIG.DIN_TO 8 \
  CONFIG.DIN_WIDTH 9 \
  CONFIG.DOUT_WIDTH 1 \
] [get_bd_cells RGB_green_xlslice_8to8_0]
create_bd_cell -type ip -vlnv xilinx.com:ip:xlslice:1.0 LCD_BL_xlslice_8to8_0
set_property -dict {CONFIG.DIN_FROM 8 CONFIG.DIN_TO 8 CONFIG.DIN_WIDTH 9 CONFIG.DOUT_WIDTH 1} [get_bd_cells LCD_BL_xlslice_8to8_0]
create_bd_cell -type ip -vlnv xilinx.com:ip:xlslice:1.0 RGB_red_xlslice_8to8_0
set_property -dict [list \
  CONFIG.DIN_FROM 8 \
  CONFIG.DIN_TO 8 \
  CONFIG.DIN_WIDTH 9 \
  CONFIG.DOUT_WIDTH 1 \
] [get_bd_cells RGB_red_xlslice_8to8_0]
create_bd_cell -type ip -vlnv xilinx.com:ip:xlconstant:1.1 xlconstant_0_len16
set_property -dict {CONFIG.CONST_VAL 0 CONFIG.CONST_WIDTH 16} [get_bd_cells xlconstant_0_len16]
create_bd_cell -type ip -vlnv xilinx.com:ip:xlslice:1.0 PWM_GPIO2_xlslice_15to0_0
set_property -dict {CONFIG.DIN_FROM 15 CONFIG.DIN_WIDTH 32 CONFIG.DOUT_WIDTH 16} [get_bd_cells PWM_GPIO2_xlslice_15to0_0]
create_bd_cell -type ip -vlnv xilinx.com:ip:axi_gpio:2.0 axi_PWM_gpio_0
set_property -dict [list \
  CONFIG.C_ALL_INPUTS 0 \
  CONFIG.C_ALL_INPUTS_2 0 \
  CONFIG.C_ALL_OUTPUTS 1 \
  CONFIG.C_ALL_OUTPUTS_2 0 \
  CONFIG.C_DOUT_DEFAULT 0x20010101 \
  CONFIG.C_GPIO2_WIDTH 32 \
  CONFIG.C_GPIO_WIDTH 32 \
  CONFIG.C_INTERRUPT_PRESENT 1 \
  CONFIG.C_IS_DUAL 1 \
  CONFIG.C_TRI_DEFAULT_2 0x0000FFFF \
] [get_bd_cells axi_PWM_gpio_0]
create_bd_cell -type ip -vlnv xilinx.com:ip:xlconcat:2.1 PWM_GPIO2_xlconcat_0
set_property -dict [list \
  CONFIG.IN0_WIDTH 16 \
  CONFIG.IN1_WIDTH 16 \
  CONFIG.IN2_WIDTH 1 \
  CONFIG.IN3_WIDTH 1 \
  CONFIG.IN4_WIDTH 1 \
  CONFIG.IN5_WIDTH 12 \
  CONFIG.NUM_PORTS 2 \
  CONFIG.dout_width 32 \
] [get_bd_cells PWM_GPIO2_xlconcat_0]

# ---- hierarchy /ROTENC_decoder ----
current_bd_instance /ROTENC_decoder
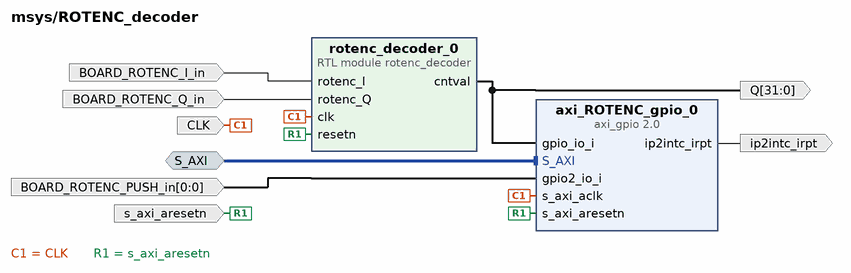
[diagram p10: block diagram inside /ROTENC_decoder]
create_bd_intf_pin -mode Slave -vlnv xilinx.com:interface:aximm_rtl:1.0 S_AXI
create_bd_pin -dir I -type clk CLK
create_bd_pin -dir O -type intr ip2intc_irpt
create_bd_pin -dir I -type rst s_axi_aresetn
create_bd_pin -dir I -from 0 -to 0 BOARD_ROTENC_PUSH_in
create_bd_pin -dir O -from 31 -to 0 -type data Q
create_bd_pin -dir I BOARD_ROTENC_I_in
create_bd_pin -dir I BOARD_ROTENC_Q_in

create_bd_cell -type ip -vlnv xilinx.com:ip:axi_gpio:2.0 axi_ROTENC_gpio_0
set_property -dict [list \
  CONFIG.C_ALL_INPUTS 1 \
  CONFIG.C_ALL_INPUTS_2 1 \
  CONFIG.C_GPIO2_WIDTH 1 \
  CONFIG.C_GPIO_WIDTH 32 \
  CONFIG.C_INTERRUPT_PRESENT 1 \
  CONFIG.C_IS_DUAL 1 \
] [get_bd_cells axi_ROTENC_gpio_0]
create_bd_cell -type module -reference rotenc_decoder rotenc_decoder_0

# ---- hierarchy /ETH0 ----
current_bd_instance /ETH0
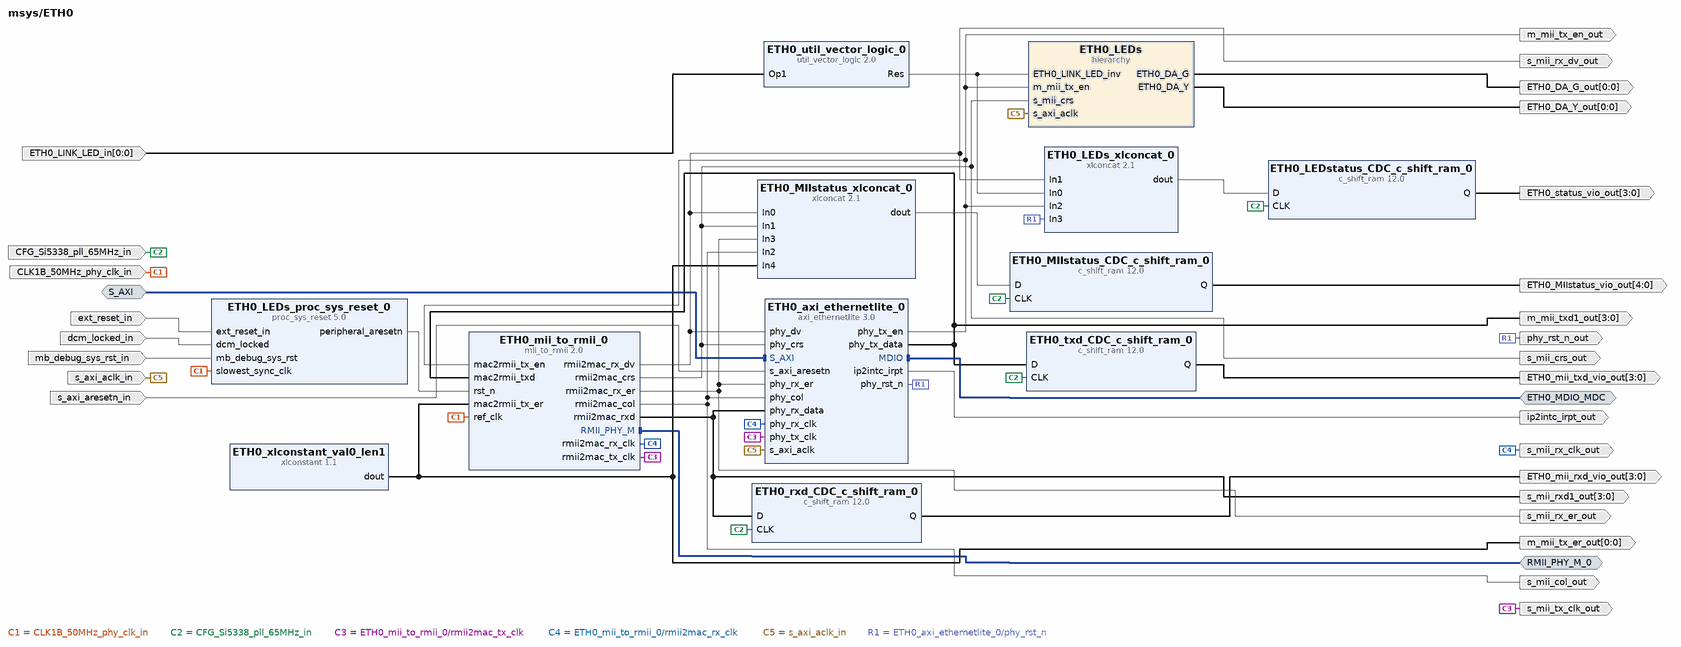
[diagram p11: block diagram inside /ETH0]
create_bd_intf_pin -mode Master -vlnv xilinx.com:interface:rmii_rtl:1.0 RMII_PHY_M_0
create_bd_intf_pin -mode Slave -vlnv xilinx.com:interface:aximm_rtl:1.0 S_AXI
create_bd_intf_pin -mode Master -vlnv xilinx.com:interface:mdio_rtl:1.0 ETH0_MDIO_MDC
create_bd_pin -dir O -from 0 -to 0 ETH0_DA_Y_out
create_bd_pin -dir O -from 0 -to 0 ETH0_DA_G_out
create_bd_pin -dir I -type clk CLK1B_50MHz_phy_clk_in
create_bd_pin -dir O -type intr ip2intc_irpt_out
create_bd_pin -dir I -from 0 -to 0 ETH0_LINK_LED_in
create_bd_pin -dir I -type rst ext_reset_in
create_bd_pin -dir I dcm_locked_in
create_bd_pin -dir I -type clk CFG_Si5338_pll_65MHz_in
create_bd_pin -dir O -type clk s_mii_tx_clk_out
create_bd_pin -dir O -type clk s_mii_rx_clk_out
create_bd_pin -dir I -type clk s_axi_aclk_in
create_bd_pin -dir I -type rst s_axi_aresetn_in
create_bd_pin -dir O -from 3 -to 0 -type data ETH0_status_vio_out
create_bd_pin -dir O -from 3 -to 0 ETH0_mii_txd_vio_out
create_bd_pin -dir O -from 3 -to 0 ETH0_mii_rxd_vio_out
create_bd_pin -dir I -type rst mb_debug_sys_rst_in
create_bd_pin -dir O -from 4 -to 0 -type data ETH0_MIIstatus_vio_out
create_bd_pin -dir O s_mii_col_out
create_bd_pin -dir O s_mii_crs_out
create_bd_pin -dir O s_mii_rx_dv_out
create_bd_pin -dir O -from 3 -to 0 s_mii_rxd1_out
create_bd_pin -dir O s_mii_rx_er_out
create_bd_pin -dir O m_mii_tx_en_out
create_bd_pin -dir O -from 3 -to 0 m_mii_txd1_out
create_bd_pin -dir O -from 0 -to 0 m_mii_tx_er_out
create_bd_pin -dir O phy_rst_n_out

create_bd_cell -type hier ETH0_LEDs
create_bd_cell -type ip -vlnv xilinx.com:ip:mii_to_rmii:2.0 ETH0_mii_to_rmii_0
set_property -dict [list \
  CONFIG.C_FIXED_SPEED 1 \
  CONFIG.C_INCLUDE_BUF 0 \
  CONFIG.C_SPEED_100 1 \
  CONFIG.RMII_BOARD_INTERFACE ETH0_RMII \
] [get_bd_cells ETH0_mii_to_rmii_0]
create_bd_cell -type ip -vlnv xilinx.com:ip:proc_sys_reset:5.0 ETH0_LEDs_proc_sys_reset_0
create_bd_cell -type ip -vlnv xilinx.com:ip:c_shift_ram:12.0 ETH0_LEDstatus_CDC_c_shift_ram_0
set_property -dict [list \
  CONFIG.AsyncInitVal 0000 \
  CONFIG.DefaultData 0000 \
  CONFIG.Depth 2 \
  CONFIG.Width 4 \
] [get_bd_cells ETH0_LEDstatus_CDC_c_shift_ram_0]
create_bd_cell -type ip -vlnv xilinx.com:ip:c_shift_ram:12.0 ETH0_txd_CDC_c_shift_ram_0
set_property -dict [list \
  CONFIG.AsyncInitVal 0000 \
  CONFIG.DefaultData 0000 \
  CONFIG.Depth 2 \
  CONFIG.Width 4 \
] [get_bd_cells ETH0_txd_CDC_c_shift_ram_0]
create_bd_cell -type ip -vlnv xilinx.com:ip:c_shift_ram:12.0 ETH0_rxd_CDC_c_shift_ram_0
set_property -dict [list \
  CONFIG.AsyncInitVal 0000 \
  CONFIG.DefaultData 0000 \
  CONFIG.Depth 2 \
  CONFIG.Width 4 \
] [get_bd_cells ETH0_rxd_CDC_c_shift_ram_0]
create_bd_cell -type ip -vlnv xilinx.com:ip:c_shift_ram:12.0 ETH0_MIIstatus_CDC_c_shift_ram_0
set_property -dict [list \
  CONFIG.AsyncInitVal 00000 \
  CONFIG.DefaultData 00000 \
  CONFIG.Depth 2 \
  CONFIG.Width 5 \
] [get_bd_cells ETH0_MIIstatus_CDC_c_shift_ram_0]
create_bd_cell -type ip -vlnv xilinx.com:ip:xlconstant:1.1 ETH0_xlconstant_val0_len1
set_property -dict {CONFIG.CONST_VAL 0} [get_bd_cells ETH0_xlconstant_val0_len1]
create_bd_cell -type ip -vlnv xilinx.com:ip:axi_ethernetlite:3.0 ETH0_axi_ethernetlite_0
set_property -dict {CONFIG.C_S_AXI_PROTOCOL AXI4 CONFIG.MDIO_BOARD_INTERFACE ETH0_MDIO_MDC} [get_bd_cells ETH0_axi_ethernetlite_0]
create_bd_cell -type ip -vlnv xilinx.com:ip:util_vector_logic:2.0 ETH0_util_vector_logic_0
set_property -dict {CONFIG.C_OPERATION not CONFIG.C_SIZE 1} [get_bd_cells ETH0_util_vector_logic_0]
create_bd_cell -type ip -vlnv xilinx.com:ip:xlconcat:2.1 ETH0_MIIstatus_xlconcat_0
set_property -dict [list \
  CONFIG.IN0_WIDTH 1 \
  CONFIG.IN1_WIDTH 1 \
  CONFIG.IN2_WIDTH 1 \
  CONFIG.IN3_WIDTH 1 \
  CONFIG.IN4_WIDTH 1 \
  CONFIG.NUM_PORTS 5 \
  CONFIG.dout_width 5 \
] [get_bd_cells ETH0_MIIstatus_xlconcat_0]
create_bd_cell -type ip -vlnv xilinx.com:ip:xlconcat:2.1 ETH0_LEDs_xlconcat_0
set_property -dict [list \
  CONFIG.IN0_WIDTH 1 \
  CONFIG.IN1_WIDTH 1 \
  CONFIG.IN2_WIDTH 1 \
  CONFIG.IN3_WIDTH 1 \
  CONFIG.NUM_PORTS 4 \
  CONFIG.dout_width 4 \
] [get_bd_cells ETH0_LEDs_xlconcat_0]

# ---- hierarchy /ETH0/ETH0_LEDs ----
current_bd_instance /ETH0/ETH0_LEDs
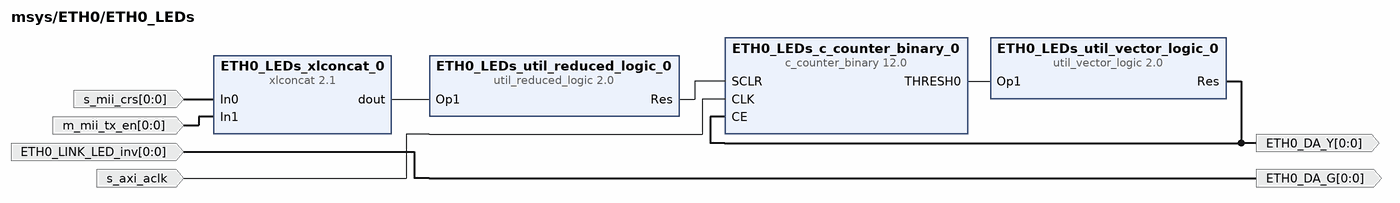
[diagram p12: block diagram inside /ETH0/ETH0_LEDs]
create_bd_pin -dir O -from 0 -to 0 ETH0_DA_Y
create_bd_pin -dir O -from 0 -to 0 ETH0_DA_G
create_bd_pin -dir I -from 0 -to 0 ETH0_LINK_LED_inv
create_bd_pin -dir I -from 0 -to 0 s_mii_crs
create_bd_pin -dir I -from 0 -to 0 m_mii_tx_en
create_bd_pin -dir I -type clk s_axi_aclk

create_bd_cell -type ip -vlnv xilinx.com:ip:util_reduced_logic:2.0 ETH0_LEDs_util_reduced_logic_0
set_property -dict {CONFIG.C_OPERATION or CONFIG.C_SIZE 2} [get_bd_cells ETH0_LEDs_util_reduced_logic_0]
create_bd_cell -type ip -vlnv xilinx.com:ip:c_counter_binary:12.0 ETH0_LEDs_c_counter_binary_0
set_property -dict [list \
  CONFIG.CE true \
  CONFIG.Count_Mode UP \
  CONFIG.Fb_Latency 2 \
  CONFIG.Fb_Latency_Configuration Manual \
  CONFIG.Latency 2 \
  CONFIG.Latency_Configuration Manual \
  CONFIG.Load false \
  CONFIG.Output_Width 24 \
  CONFIG.Restrict_Count false \
  CONFIG.SCLR true \
  CONFIG.Sync_Threshold_Output true \
  CONFIG.Threshold_Value 98967f \
] [get_bd_cells ETH0_LEDs_c_counter_binary_0]
create_bd_cell -type ip -vlnv xilinx.com:ip:util_vector_logic:2.0 ETH0_LEDs_util_vector_logic_0
set_property -dict {CONFIG.C_OPERATION not CONFIG.C_SIZE 1} [get_bd_cells ETH0_LEDs_util_vector_logic_0]
create_bd_cell -type ip -vlnv xilinx.com:ip:xlconcat:2.1 ETH0_LEDs_xlconcat_0

# ---- hierarchy /INT_ctrl ----
current_bd_instance /INT_ctrl
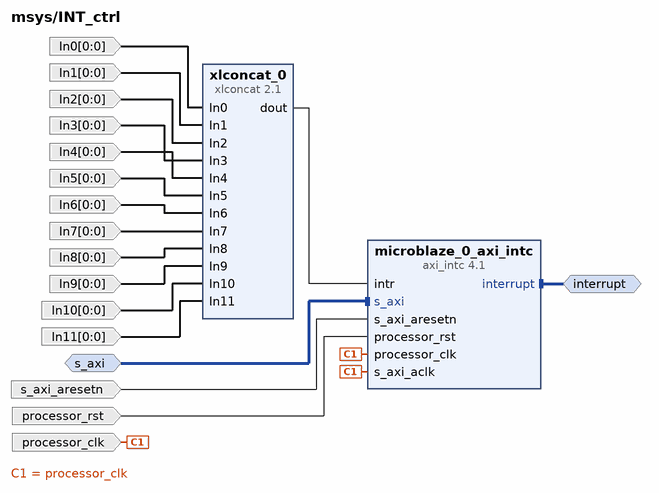
[diagram p13: block diagram inside /INT_ctrl]
create_bd_intf_pin -mode Slave -vlnv xilinx.com:interface:aximm_rtl:1.0 s_axi
create_bd_intf_pin -mode Master -vlnv xilinx.com:interface:mbinterrupt_rtl:1.0 interrupt
create_bd_pin -dir I -from 0 -to 0 In3
create_bd_pin -dir I -from 0 -to 0 In2
create_bd_pin -dir I -from 0 -to 0 In0
create_bd_pin -dir I -from 0 -to 0 In9
create_bd_pin -dir I -from 0 -to 0 In5
create_bd_pin -dir I -from 0 -to 0 In6
create_bd_pin -dir I -from 0 -to 0 In8
create_bd_pin -dir I -from 0 -to 0 In1
create_bd_pin -dir I -from 0 -to 0 In10
create_bd_pin -dir I -from 0 -to 0 In4
create_bd_pin -dir I -from 0 -to 0 In7
create_bd_pin -dir I -type clk processor_clk
create_bd_pin -dir I -type rst s_axi_aresetn
create_bd_pin -dir I -type rst processor_rst
create_bd_pin -dir I -from 0 -to 0 In11

create_bd_cell -type ip -vlnv xilinx.com:ip:axi_intc:4.1 microblaze_0_axi_intc
set_property -dict [list \
  CONFIG.C_HAS_FAST 1 \
  CONFIG.C_IRQ_IS_LEVEL 1 \
  CONFIG.C_MB_CLK_NOT_CONNECTED 1 \
] [get_bd_cells microblaze_0_axi_intc]
create_bd_cell -type ip -vlnv xilinx.com:ip:xlconcat:2.1 xlconcat_0
set_property -dict {CONFIG.NUM_PORTS 12 CONFIG.dout_width 12} [get_bd_cells xlconcat_0]

# ---- hierarchy /EUI48 ----
current_bd_instance /EUI48
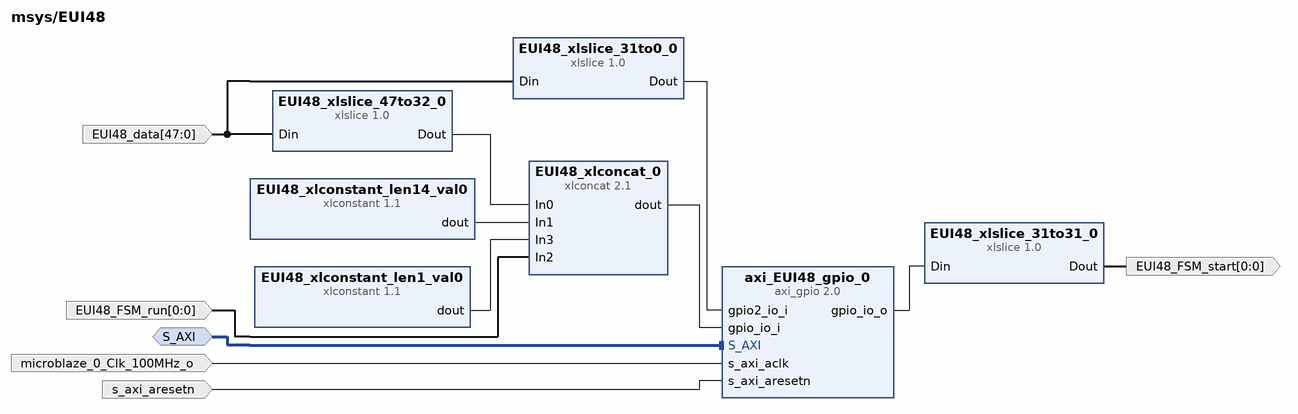
[diagram p14: block diagram inside /EUI48]
create_bd_intf_pin -mode Slave -vlnv xilinx.com:interface:aximm_rtl:1.0 S_AXI
create_bd_pin -dir I -type clk microblaze_0_Clk_100MHz_o
create_bd_pin -dir I -type rst s_axi_aresetn
create_bd_pin -dir O -from 0 -to 0 EUI48_FSM_start
create_bd_pin -dir I -from 0 -to 0 EUI48_FSM_run
create_bd_pin -dir I -from 47 -to 0 EUI48_data

create_bd_cell -type ip -vlnv xilinx.com:ip:xlslice:1.0 EUI48_xlslice_47to32_0
set_property -dict [list \
  CONFIG.DIN_FROM 47 \
  CONFIG.DIN_TO 32 \
  CONFIG.DIN_WIDTH 48 \
  CONFIG.DOUT_WIDTH 16 \
] [get_bd_cells EUI48_xlslice_47to32_0]
create_bd_cell -type ip -vlnv xilinx.com:ip:xlslice:1.0 EUI48_xlslice_31to0_0
set_property -dict {CONFIG.DIN_FROM 31 CONFIG.DIN_WIDTH 48 CONFIG.DOUT_WIDTH 32} [get_bd_cells EUI48_xlslice_31to0_0]
create_bd_cell -type ip -vlnv xilinx.com:ip:xlconstant:1.1 EUI48_xlconstant_len14_val0
set_property -dict {CONFIG.CONST_VAL 0 CONFIG.CONST_WIDTH 14} [get_bd_cells EUI48_xlconstant_len14_val0]
create_bd_cell -type ip -vlnv xilinx.com:ip:xlslice:1.0 EUI48_xlslice_31to31_0
set_property -dict {CONFIG.DIN_FROM 31 CONFIG.DIN_TO 31 CONFIG.DOUT_WIDTH 1} [get_bd_cells EUI48_xlslice_31to31_0]
create_bd_cell -type ip -vlnv xilinx.com:ip:xlconstant:1.1 EUI48_xlconstant_len1_val0
create_bd_cell -type ip -vlnv xilinx.com:ip:axi_gpio:2.0 axi_EUI48_gpio_0
set_property -dict [list \
  CONFIG.C_ALL_INPUTS 0 \
  CONFIG.C_ALL_INPUTS_2 1 \
  CONFIG.C_ALL_OUTPUTS 0 \
  CONFIG.C_DOUT_DEFAULT 0x00000000 \
  CONFIG.C_GPIO2_WIDTH 32 \
  CONFIG.C_GPIO_WIDTH 32 \
  CONFIG.C_INTERRUPT_PRESENT 0 \
  CONFIG.C_IS_DUAL 1 \
  CONFIG.C_TRI_DEFAULT 0x0000FFFF \
] [get_bd_cells axi_EUI48_gpio_0]
create_bd_cell -type ip -vlnv xilinx.com:ip:xlconcat:2.1 EUI48_xlconcat_0
set_property -dict [list \
  CONFIG.IN0_WIDTH 16 \
  CONFIG.IN1_WIDTH 14 \
  CONFIG.IN2_WIDTH 1 \
  CONFIG.IN3_WIDTH 1 \
  CONFIG.NUM_PORTS 4 \
  CONFIG.dout_width 32 \
] [get_bd_cells EUI48_xlconcat_0]

# ---- hierarchy /CLK1B_CW_0 ----
current_bd_instance /CLK1B_CW_0
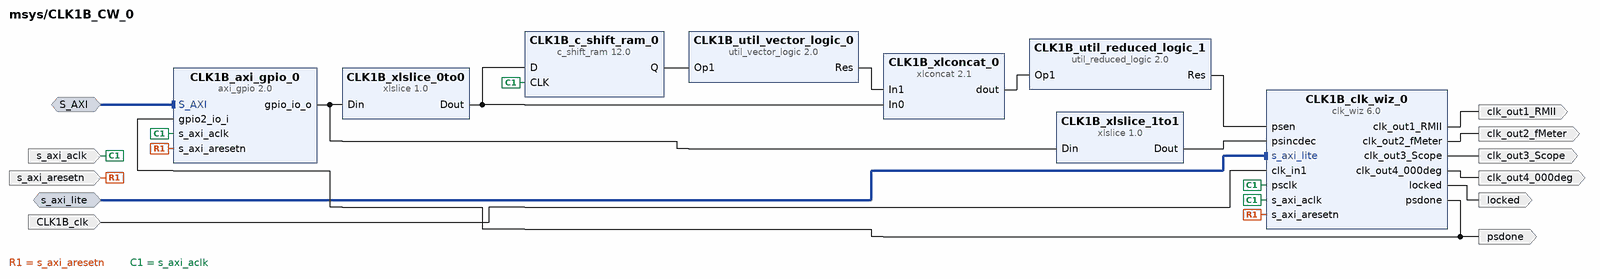
[diagram p15: block diagram inside /CLK1B_CW_0]
create_bd_intf_pin -mode Slave -vlnv xilinx.com:interface:aximm_rtl:1.0 S_AXI
create_bd_intf_pin -mode Slave -vlnv xilinx.com:interface:aximm_rtl:1.0 s_axi_lite
create_bd_pin -dir I -type clk CLK1B_clk
create_bd_pin -dir O -type clk clk_out1_RMII
create_bd_pin -dir O -type clk clk_out2_fMeter
create_bd_pin -dir O locked
create_bd_pin -dir I -type rst s_axi_aresetn
create_bd_pin -dir I -type clk s_axi_aclk
create_bd_pin -dir O -type clk clk_out3_Scope
create_bd_pin -dir O -type clk clk_out4_000deg
create_bd_pin -dir O psdone

create_bd_cell -type ip -vlnv xilinx.com:ip:c_shift_ram:12.0 CLK1B_c_shift_ram_0
set_property -dict {CONFIG.AsyncInitVal 0 CONFIG.DefaultData 0 CONFIG.Depth 1 CONFIG.Width 1} [get_bd_cells CLK1B_c_shift_ram_0]
create_bd_cell -type ip -vlnv xilinx.com:ip:xlslice:1.0 CLK1B_xlslice_0to0
set_property -dict {CONFIG.DIN_WIDTH 2} [get_bd_cells CLK1B_xlslice_0to0]
create_bd_cell -type ip -vlnv xilinx.com:ip:xlslice:1.0 CLK1B_xlslice_1to1
set_property -dict {CONFIG.DIN_FROM 1 CONFIG.DIN_TO 1 CONFIG.DIN_WIDTH 2 CONFIG.DOUT_WIDTH 1} [get_bd_cells CLK1B_xlslice_1to1]
create_bd_cell -type ip -vlnv xilinx.com:ip:util_reduced_logic:2.0 CLK1B_util_reduced_logic_1
set_property -dict {CONFIG.C_SIZE 2} [get_bd_cells CLK1B_util_reduced_logic_1]
create_bd_cell -type ip -vlnv xilinx.com:ip:axi_gpio:2.0 CLK1B_axi_gpio_0
set_property -dict [list \
  CONFIG.C_ALL_INPUTS_2 1 \
  CONFIG.C_ALL_OUTPUTS 1 \
  CONFIG.C_GPIO2_WIDTH 1 \
  CONFIG.C_GPIO_WIDTH 2 \
  CONFIG.C_IS_DUAL 1 \
] [get_bd_cells CLK1B_axi_gpio_0]
create_bd_cell -type ip -vlnv xilinx.com:ip:clk_wiz:6.0 CLK1B_clk_wiz_0
set_property -dict [list \
  CONFIG.AXI_DRP true \
  CONFIG.CLKIN1_JITTER_PS 200.0 \
  CONFIG.CLKOUT1_DRIVES BUFG \
  CONFIG.CLKOUT1_JITTER 243.865 \
  CONFIG.CLKOUT1_PHASE_ERROR 148.661 \
  CONFIG.CLKOUT1_REQUESTED_OUT_FREQ 50.000 \
  CONFIG.CLKOUT1_REQUESTED_PHASE 0.000 \
  CONFIG.CLKOUT2_DRIVES BUFG \
  CONFIG.CLKOUT2_JITTER 243.865 \
  CONFIG.CLKOUT2_PHASE_ERROR 148.661 \
  CONFIG.CLKOUT2_REQUESTED_OUT_FREQ 50.000 \
  CONFIG.CLKOUT2_USED true \
  CONFIG.CLKOUT3_DRIVES BUFG \
  CONFIG.CLKOUT3_JITTER 243.865 \
  CONFIG.CLKOUT3_PHASE_ERROR 148.661 \
  CONFIG.CLKOUT3_REQUESTED_OUT_FREQ 50.000 \
  CONFIG.CLKOUT3_USED true \
  CONFIG.CLKOUT4_DRIVES BUFG \
  CONFIG.CLKOUT4_JITTER 243.865 \
  CONFIG.CLKOUT4_PHASE_ERROR 148.661 \
  CONFIG.CLKOUT4_REQUESTED_OUT_FREQ 50.000 \
  CONFIG.CLKOUT4_USED true \
  CONFIG.CLKOUT5_DRIVES BUFG \
  CONFIG.CLKOUT5_REQUESTED_OUT_FREQ 50.000 \
  CONFIG.CLKOUT6_DRIVES BUFG \
  CONFIG.CLKOUT6_REQUESTED_OUT_FREQ 50.000 \
  CONFIG.CLKOUT7_DRIVES BUFG \
  CONFIG.CLKOUT7_REQUESTED_OUT_FREQ 50.000 \
  CONFIG.CLK_OUT1_PORT clk_out1_RMII \
  CONFIG.CLK_OUT1_USE_FINE_PS_GUI true \
  CONFIG.CLK_OUT2_PORT clk_out2_fMeter \
  CONFIG.CLK_OUT3_PORT clk_out3_Scope \
  CONFIG.CLK_OUT3_USE_FINE_PS_GUI true \
  CONFIG.CLK_OUT4_PORT clk_out4_000deg \
  CONFIG.FEEDBACK_SOURCE FDBK_AUTO \
  CONFIG.INTERFACE_SELECTION Enable_AXI \
  CONFIG.JITTER_SEL No_Jitter \
  CONFIG.MMCM_BANDWIDTH OPTIMIZED \
  CONFIG.MMCM_CLKFBOUT_MULT_F 13.000 \
  CONFIG.MMCM_CLKIN1_PERIOD 20.000 \
  CONFIG.MMCM_CLKIN2_PERIOD 10.000 \
  CONFIG.MMCM_CLKOUT0_DIVIDE_F 13.000 \
  CONFIG.MMCM_CLKOUT0_DUTY_CYCLE 0.5 \
  CONFIG.MMCM_CLKOUT0_PHASE 0.000 \
  CONFIG.MMCM_CLKOUT0_USE_FINE_PS true \
  CONFIG.MMCM_CLKOUT1_DIVIDE 13 \
  CONFIG.MMCM_CLKOUT1_DUTY_CYCLE 0.5 \
  CONFIG.MMCM_CLKOUT2_DIVIDE 13 \
  CONFIG.MMCM_CLKOUT2_DUTY_CYCLE 0.5 \
  CONFIG.MMCM_CLKOUT2_USE_FINE_PS true \
  CONFIG.MMCM_CLKOUT3_DIVIDE 13 \
  CONFIG.MMCM_CLKOUT3_DUTY_CYCLE 0.5 \
  CONFIG.MMCM_COMPENSATION ZHOLD \
  CONFIG.NUM_OUT_CLKS 4 \
  CONFIG.PHASE_DUTY_CONFIG false \
  CONFIG.PRIMITIVE MMCM \
  CONFIG.PRIM_IN_FREQ 50.000 \
  CONFIG.USE_DYN_PHASE_SHIFT true \
  CONFIG.USE_DYN_RECONFIG true \
  CONFIG.USE_FREQ_SYNTH false \
  CONFIG.USE_MIN_POWER true \
  CONFIG.USE_SAFE_CLOCK_STARTUP false \
] [get_bd_cells CLK1B_clk_wiz_0]
create_bd_cell -type ip -vlnv xilinx.com:ip:util_vector_logic:2.0 CLK1B_util_vector_logic_0
set_property -dict {CONFIG.C_OPERATION not CONFIG.C_SIZE 1} [get_bd_cells CLK1B_util_vector_logic_0]
create_bd_cell -type ip -vlnv xilinx.com:ip:xlconcat:2.1 CLK1B_xlconcat_0

# ---- hierarchy /SCOPE ----
current_bd_instance /SCOPE
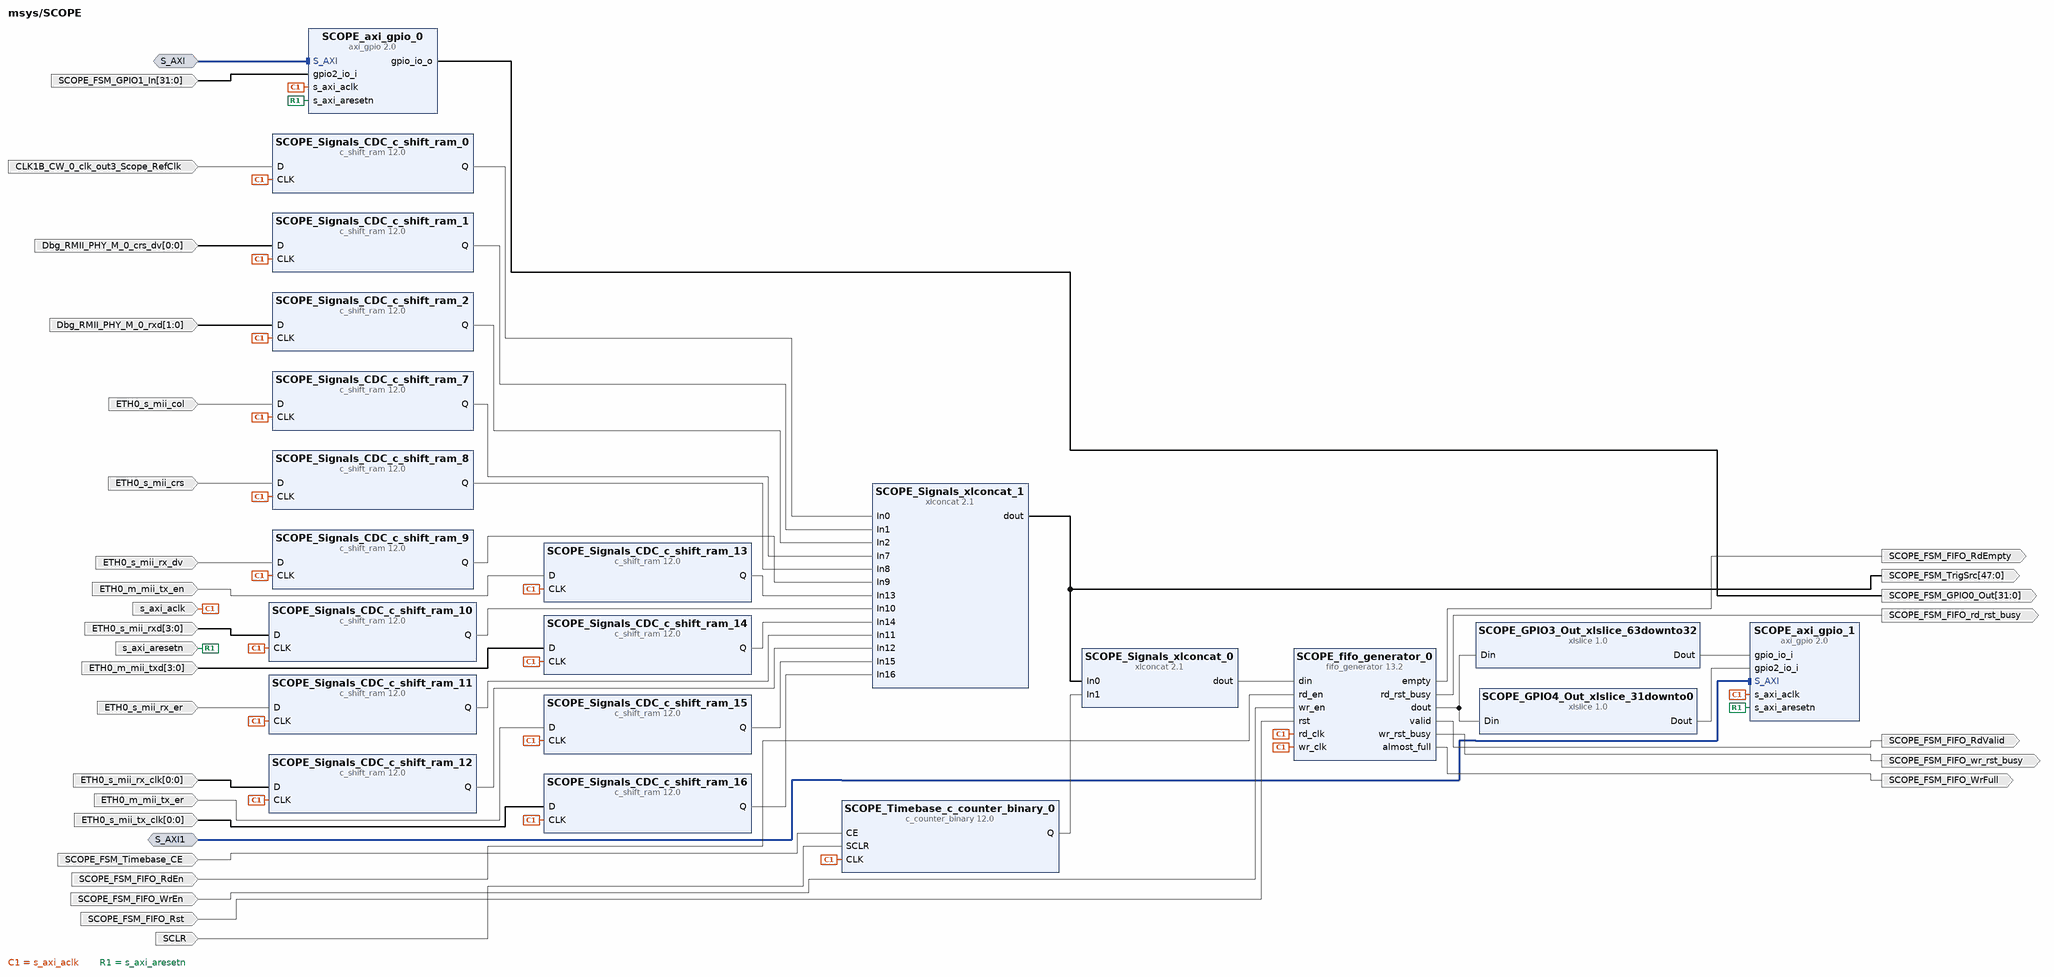
[diagram p16: block diagram inside /SCOPE]
create_bd_intf_pin -mode Slave -vlnv xilinx.com:interface:aximm_rtl:1.0 S_AXI
create_bd_intf_pin -mode Slave -vlnv xilinx.com:interface:aximm_rtl:1.0 S_AXI1
create_bd_pin -dir I -type clk s_axi_aclk
create_bd_pin -dir I -type rst s_axi_aresetn
create_bd_pin -dir I -type clk CLK1B_CW_0_clk_out3_Scope_RefClk
create_bd_pin -dir I ETH0_s_mii_col
create_bd_pin -dir I ETH0_s_mii_crs
create_bd_pin -dir I ETH0_s_mii_rx_dv
create_bd_pin -dir I -from 3 -to 0 ETH0_s_mii_rxd
create_bd_pin -dir I ETH0_s_mii_rx_er
create_bd_pin -dir I -from 0 -to 0 ETH0_s_mii_rx_clk
create_bd_pin -dir I ETH0_m_mii_tx_en
create_bd_pin -dir I -from 3 -to 0 ETH0_m_mii_txd
create_bd_pin -dir I ETH0_m_mii_tx_er
create_bd_pin -dir I -from 0 -to 0 ETH0_s_mii_tx_clk
create_bd_pin -dir I -type ce SCOPE_FSM_Timebase_CE
create_bd_pin -dir I SCOPE_FSM_FIFO_Rst
create_bd_pin -dir I SCOPE_FSM_FIFO_RdEn
create_bd_pin -dir O SCOPE_FSM_FIFO_WrFull
create_bd_pin -dir O SCOPE_FSM_FIFO_RdValid
create_bd_pin -dir O SCOPE_FSM_FIFO_RdEmpty
create_bd_pin -dir O -from 47 -to 0 -type data SCOPE_FSM_TrigSrc
create_bd_pin -dir I SCOPE_FSM_FIFO_WrEn
create_bd_pin -dir O SCOPE_FSM_FIFO_wr_rst_busy
create_bd_pin -dir O SCOPE_FSM_FIFO_rd_rst_busy
create_bd_pin -dir O -from 31 -to 0 SCOPE_FSM_GPIO0_Out
create_bd_pin -dir I -from 31 -to 0 SCOPE_FSM_GPIO1_In
create_bd_pin -dir I -from 0 -to 0 Dbg_RMII_PHY_M_0_crs_dv
create_bd_pin -dir I -from 1 -to 0 Dbg_RMII_PHY_M_0_rxd
create_bd_pin -dir I -type rst SCLR

create_bd_cell -type ip -vlnv xilinx.com:ip:c_counter_binary:12.0 SCOPE_Timebase_c_counter_binary_0
set_property -dict {CONFIG.CE true CONFIG.Output_Width 16 CONFIG.SCLR true} [get_bd_cells SCOPE_Timebase_c_counter_binary_0]
create_bd_cell -type ip -vlnv xilinx.com:ip:c_shift_ram:12.0 SCOPE_Signals_CDC_c_shift_ram_0
set_property -dict [list \
  CONFIG.AsyncInitVal 0 \
  CONFIG.DefaultData 0 \
  CONFIG.Depth 2 \
  CONFIG.Width 1 \
] [get_bd_cells SCOPE_Signals_CDC_c_shift_ram_0]
create_bd_cell -type ip -vlnv xilinx.com:ip:fifo_generator:13.2 SCOPE_fifo_generator_0
set_property -dict [list \
  CONFIG.Almost_Full_Flag true \
  CONFIG.Enable_Reset_Synchronization true \
  CONFIG.Enable_Safety_Circuit true \
  CONFIG.FIFO_Implementation_rach Common_Clock_Distributed_RAM \
  CONFIG.FIFO_Implementation_wach Common_Clock_Distributed_RAM \
  CONFIG.FIFO_Implementation_wrch Common_Clock_Distributed_RAM \
  CONFIG.Fifo_Implementation Independent_Clocks_Block_RAM \
  CONFIG.Full_Flags_Reset_Value 1 \
  CONFIG.INTERFACE_TYPE Native \
  CONFIG.Input_Data_Width 64 \
  CONFIG.Input_Depth 1024 \
  CONFIG.Output_Data_Width 64 \
  CONFIG.READ_WRITE_MODE READ_ONLY \
  CONFIG.Reset_Pin true \
  CONFIG.Use_Dout_Reset true \
  CONFIG.Use_Embedded_Registers false \
  CONFIG.Valid_Flag true \
] [get_bd_cells SCOPE_fifo_generator_0]
create_bd_cell -type ip -vlnv xilinx.com:ip:xlslice:1.0 SCOPE_GPIO3_Out_xlslice_63downto32
set_property -dict [list \
  CONFIG.DIN_FROM 63 \
  CONFIG.DIN_TO 32 \
  CONFIG.DIN_WIDTH 64 \
  CONFIG.DOUT_WIDTH 32 \
] [get_bd_cells SCOPE_GPIO3_Out_xlslice_63downto32]
create_bd_cell -type ip -vlnv xilinx.com:ip:xlslice:1.0 SCOPE_GPIO4_Out_xlslice_31downto0
set_property -dict {CONFIG.DIN_FROM 31 CONFIG.DIN_WIDTH 64 CONFIG.DOUT_WIDTH 32} [get_bd_cells SCOPE_GPIO4_Out_xlslice_31downto0]
create_bd_cell -type ip -vlnv xilinx.com:ip:c_shift_ram:12.0 SCOPE_Signals_CDC_c_shift_ram_1
set_property -dict [list \
  CONFIG.AsyncInitVal 0 \
  CONFIG.DefaultData 0 \
  CONFIG.Depth 2 \
  CONFIG.Width 1 \
] [get_bd_cells SCOPE_Signals_CDC_c_shift_ram_1]
create_bd_cell -type ip -vlnv xilinx.com:ip:c_shift_ram:12.0 SCOPE_Signals_CDC_c_shift_ram_2
set_property -dict [list \
  CONFIG.AsyncInitVal 00 \
  CONFIG.DefaultData 00 \
  CONFIG.Depth 2 \
  CONFIG.Width 2 \
] [get_bd_cells SCOPE_Signals_CDC_c_shift_ram_2]
create_bd_cell -type ip -vlnv xilinx.com:ip:c_shift_ram:12.0 SCOPE_Signals_CDC_c_shift_ram_7
set_property -dict [list \
  CONFIG.AsyncInitVal 0 \
  CONFIG.DefaultData 0 \
  CONFIG.Depth 2 \
  CONFIG.Width 1 \
] [get_bd_cells SCOPE_Signals_CDC_c_shift_ram_7]
create_bd_cell -type ip -vlnv xilinx.com:ip:c_shift_ram:12.0 SCOPE_Signals_CDC_c_shift_ram_8
set_property -dict [list \
  CONFIG.AsyncInitVal 0 \
  CONFIG.DefaultData 0 \
  CONFIG.Depth 2 \
  CONFIG.Width 1 \
] [get_bd_cells SCOPE_Signals_CDC_c_shift_ram_8]
create_bd_cell -type ip -vlnv xilinx.com:ip:c_shift_ram:12.0 SCOPE_Signals_CDC_c_shift_ram_9
set_property -dict [list \
  CONFIG.AsyncInitVal 0 \
  CONFIG.DefaultData 0 \
  CONFIG.Depth 2 \
  CONFIG.Width 1 \
] [get_bd_cells SCOPE_Signals_CDC_c_shift_ram_9]
create_bd_cell -type ip -vlnv xilinx.com:ip:c_shift_ram:12.0 SCOPE_Signals_CDC_c_shift_ram_10
set_property -dict [list \
  CONFIG.AsyncInitVal 0000 \
  CONFIG.DefaultData 0000 \
  CONFIG.Depth 2 \
  CONFIG.Width 4 \
] [get_bd_cells SCOPE_Signals_CDC_c_shift_ram_10]
create_bd_cell -type ip -vlnv xilinx.com:ip:c_shift_ram:12.0 SCOPE_Signals_CDC_c_shift_ram_11
set_property -dict [list \
  CONFIG.AsyncInitVal 0 \
  CONFIG.DefaultData 0 \
  CONFIG.Depth 2 \
  CONFIG.Width 1 \
] [get_bd_cells SCOPE_Signals_CDC_c_shift_ram_11]
create_bd_cell -type ip -vlnv xilinx.com:ip:c_shift_ram:12.0 SCOPE_Signals_CDC_c_shift_ram_12
set_property -dict [list \
  CONFIG.AsyncInitVal 0 \
  CONFIG.DefaultData 0 \
  CONFIG.Depth 2 \
  CONFIG.Width 1 \
] [get_bd_cells SCOPE_Signals_CDC_c_shift_ram_12]
create_bd_cell -type ip -vlnv xilinx.com:ip:c_shift_ram:12.0 SCOPE_Signals_CDC_c_shift_ram_13
set_property -dict [list \
  CONFIG.AsyncInitVal 0 \
  CONFIG.DefaultData 0 \
  CONFIG.Depth 2 \
  CONFIG.Width 1 \
] [get_bd_cells SCOPE_Signals_CDC_c_shift_ram_13]
create_bd_cell -type ip -vlnv xilinx.com:ip:c_shift_ram:12.0 SCOPE_Signals_CDC_c_shift_ram_14
set_property -dict [list \
  CONFIG.AsyncInitVal 0000 \
  CONFIG.DefaultData 0000 \
  CONFIG.Depth 2 \
  CONFIG.Width 4 \
] [get_bd_cells SCOPE_Signals_CDC_c_shift_ram_14]
create_bd_cell -type ip -vlnv xilinx.com:ip:c_shift_ram:12.0 SCOPE_Signals_CDC_c_shift_ram_15
set_property -dict [list \
  CONFIG.AsyncInitVal 0 \
  CONFIG.DefaultData 0 \
  CONFIG.Depth 2 \
  CONFIG.Width 1 \
] [get_bd_cells SCOPE_Signals_CDC_c_shift_ram_15]
create_bd_cell -type ip -vlnv xilinx.com:ip:c_shift_ram:12.0 SCOPE_Signals_CDC_c_shift_ram_16
set_property -dict [list \
  CONFIG.AsyncInitVal 0 \
  CONFIG.DefaultData 0 \
  CONFIG.Depth 2 \
  CONFIG.Width 1 \
] [get_bd_cells SCOPE_Signals_CDC_c_shift_ram_16]
create_bd_cell -type ip -vlnv xilinx.com:ip:axi_gpio:2.0 SCOPE_axi_gpio_0
set_property -dict [list \
  CONFIG.C_ALL_INPUTS 0 \
  CONFIG.C_ALL_INPUTS_2 1 \
  CONFIG.C_ALL_OUTPUTS 1 \
  CONFIG.C_GPIO_WIDTH 32 \
  CONFIG.C_IS_DUAL 1 \
] [get_bd_cells SCOPE_axi_gpio_0]
create_bd_cell -type ip -vlnv xilinx.com:ip:axi_gpio:2.0 SCOPE_axi_gpio_1
set_property -dict {CONFIG.C_ALL_INPUTS 1 CONFIG.C_ALL_INPUTS_2 1 CONFIG.C_IS_DUAL 1} [get_bd_cells SCOPE_axi_gpio_1]
create_bd_cell -type ip -vlnv xilinx.com:ip:xlconcat:2.1 SCOPE_Signals_xlconcat_0
set_property -dict [list \
  CONFIG.IN0_WIDTH 48 \
  CONFIG.IN1_WIDTH 16 \
  CONFIG.IN2_WIDTH 16 \
  CONFIG.NUM_PORTS 2 \
  CONFIG.dout_width 64 \
] [get_bd_cells SCOPE_Signals_xlconcat_0]
create_bd_cell -type ip -vlnv xilinx.com:ip:xlconcat:2.1 SCOPE_Signals_xlconcat_1
set_property -dict [list \
  CONFIG.IN0_WIDTH 1 \
  CONFIG.IN10_WIDTH 4 \
  CONFIG.IN11_WIDTH 1 \
  CONFIG.IN12_WIDTH 1 \
  CONFIG.IN13_WIDTH 1 \
  CONFIG.IN14_WIDTH 4 \
  CONFIG.IN15_WIDTH 1 \
  CONFIG.IN16_WIDTH 1 \
  CONFIG.IN17_WIDTH 23 \
  CONFIG.IN1_WIDTH 1 \
  CONFIG.IN2_WIDTH 2 \
  CONFIG.IN3_WIDTH 1 \
  CONFIG.IN4_WIDTH 2 \
  CONFIG.IN5_WIDTH 1 \
  CONFIG.IN6_WIDTH 1 \
  CONFIG.IN7_WIDTH 1 \
  CONFIG.IN8_WIDTH 1 \
  CONFIG.IN9_WIDTH 1 \
  CONFIG.NUM_PORTS 18 \
  CONFIG.dout_width 48 \
] [get_bd_cells SCOPE_Signals_xlconcat_1]
